# EAGLE design ArmazEthernet - Rev A2 (EAGLE 7.5.0)

## Sheet 1 of 2
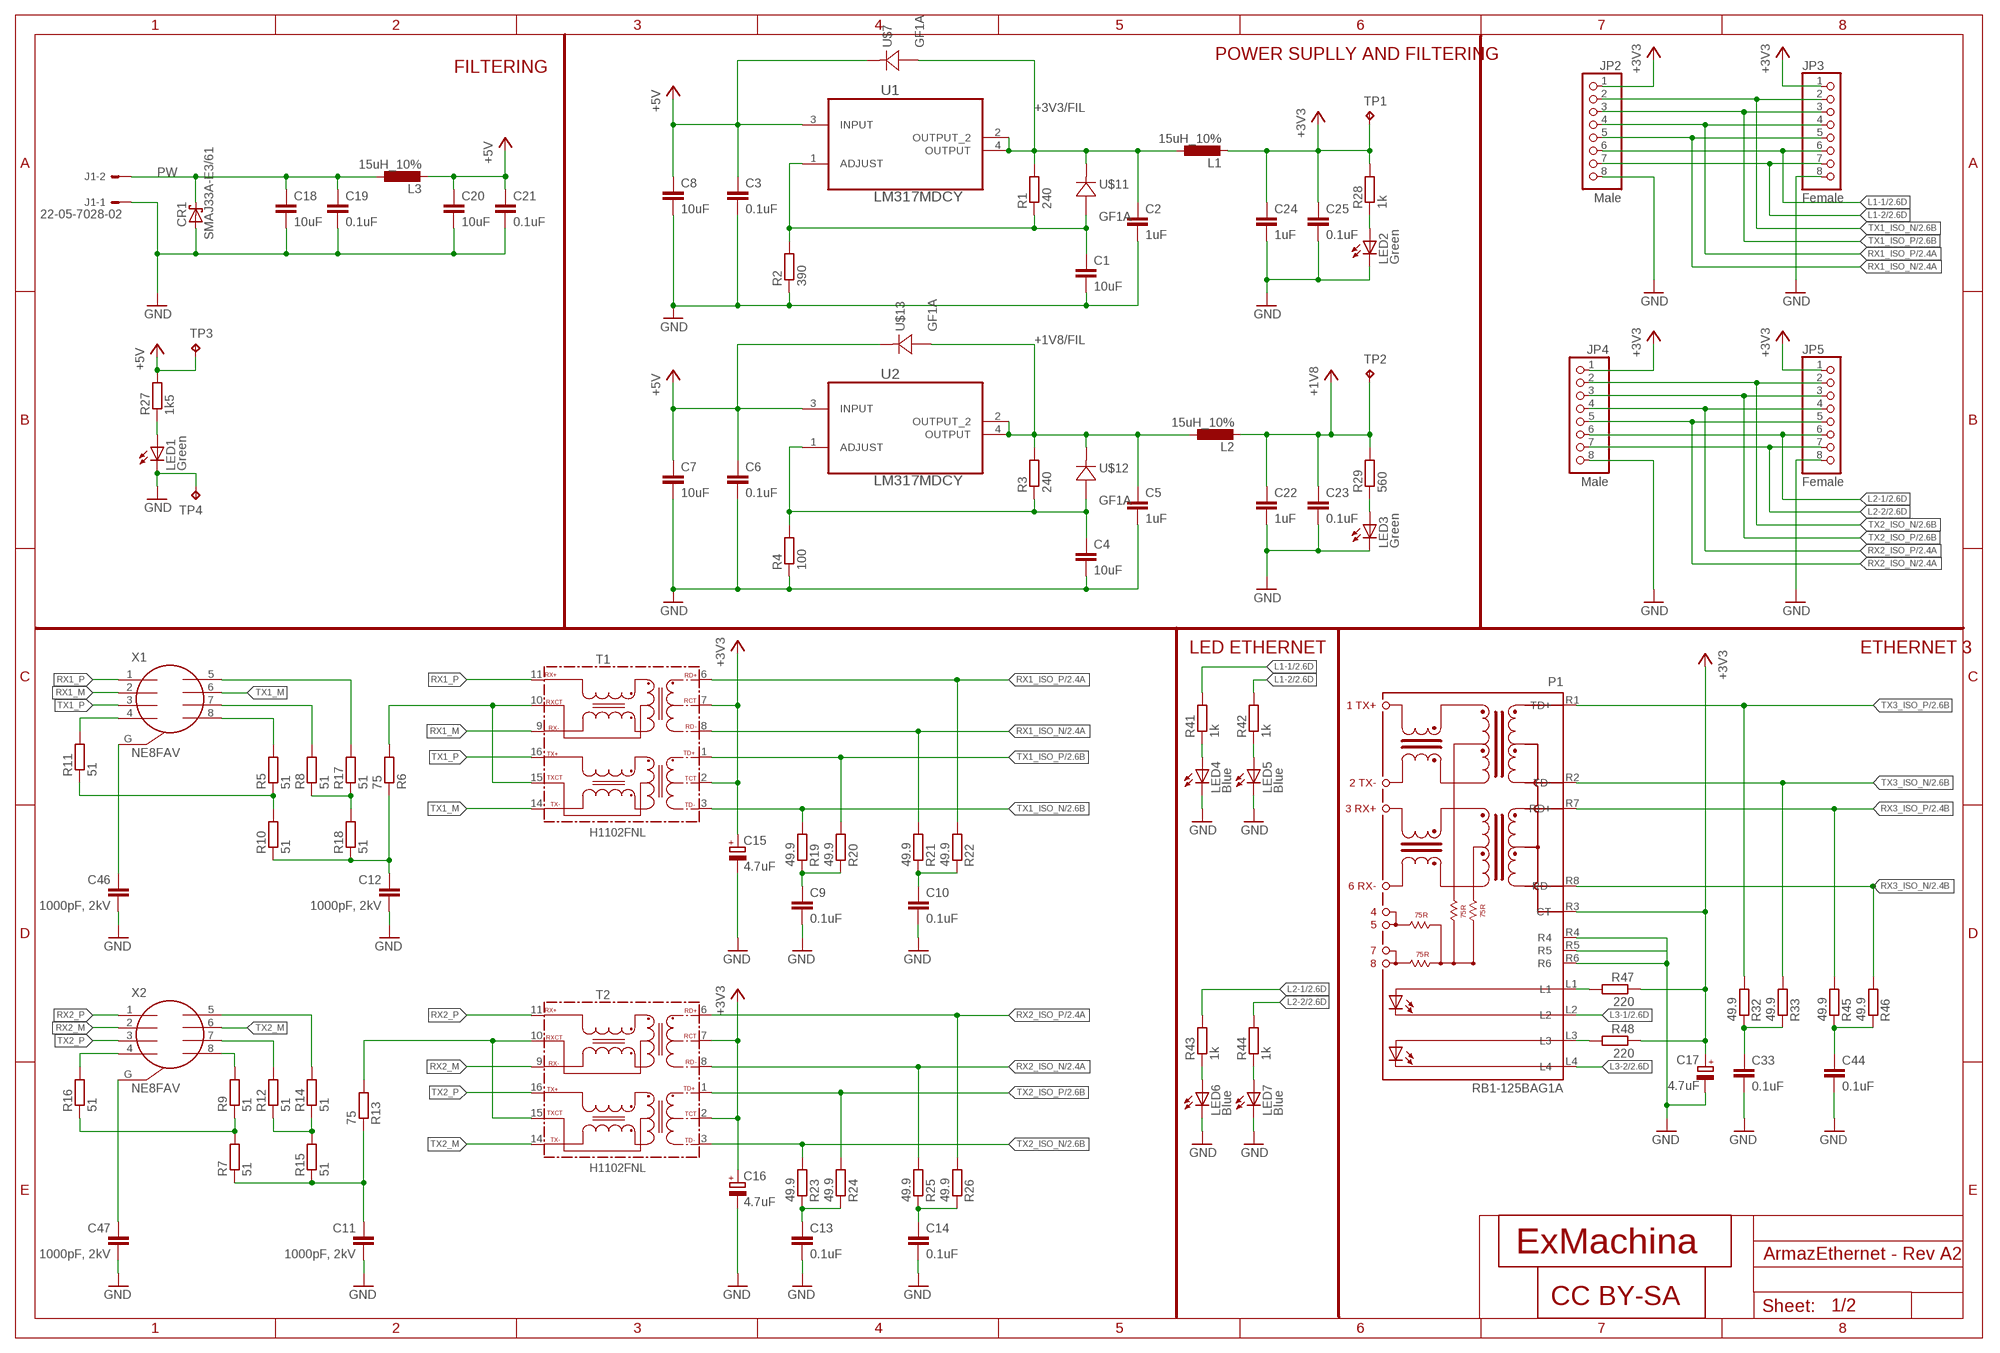
[diagram p0: schematic, sheet 1]

### Parts
C1  10uF  C-EUC0603  [C0603]
C2  1uF  C-EUC0603  [C0603]
C3  0.1uF  C-EUC0603  [C0603]
C4  10uF  C-EUC0603  [C0603]
C5  1uF  C-EUC0603  [C0603]
C6  0.1uF  C-EUC0603  [C0603]
C7  10uF  C-EUC0603  [C0603]
C8  10uF  C-EUC0603  [C0603]
C9  0.1uF  C-EUC0603  [C0603]
C10  0.1uF  C-EUC0603  [C0603]
C11  1000pF, 2kV  C-EUC1206  [C1206]
C12  1000pF, 2kV  C-EUC1206  [C1206]
C13  0.1uF  C-EUC0603  [C0603]
C14  0.1uF  C-EUC0603  [C0603]
C15  4.7uF  CPOL-EUCT3216  [CT3216]
C16  4.7uF  CPOL-EUCT3216  [CT3216]
C17  4.7uF  CPOL-EUCT3216  [CT3216]
C18  10uF  C-EUC0603  [C0603]
C19  0.1uF  C-EUC0603  [C0603]
C20  10uF  C-EUC0603  [C0603]
C21  0.1uF  C-EUC0603  [C0603]
C22  1uF  C-EUC0603  [C0603]
C23  0.1uF  C-EUC0603  [C0603]
C24  1uF  C-EUC0603  [C0603]
C25  0.1uF  C-EUC0603  [C0603]
C33  0.1uF  C-EUC0603  [C0603]
C44  0.1uF  C-EUC0603  [C0603]
C46  1000pF, 2kV  C-EUC1206  [C1206]
C47  1000pF, 2kV  C-EUC1206  [C1206]
CR1  SMAJ33A-E3/61  [DIODE_DO-214AC]
J1  22-05-7028-02  [7395-02]
JP2  Male  PINHD-1X8  [1X08]
JP3  Female  PINHD-1X8  [1X08]
JP4  Male  PINHD-1X8  [1X08]
JP5  Female  PINHD-1X8  [1X08]
L1  15uH_10%  L-EUL4532C  [L4532M]
L2  15uH_10%  L-EUL4532C  [L4532M]
L3  15uH_10%  L-EUL4532C  [L4532M]
LED1  Green  LEDCHIP-LED0603  [CHIP-LED0603]
LED2  Green  LEDCHIP-LED0603  [CHIP-LED0603]
LED3  Green  LEDCHIP-LED0603  [CHIP-LED0603]
LED4  Blue  LEDCHIP-LED0603  [CHIP-LED0603]
LED5  Blue  LEDCHIP-LED0603  [CHIP-LED0603]
LED6  Blue  LEDCHIP-LED0603  [CHIP-LED0603]
LED7  Blue  LEDCHIP-LED0603  [CHIP-LED0603]
P1  RB1-125BAG1A  [WIZNET_RB1-125BAG1A]
R1  240  R-EU_R0603  [R0603]
R2  390  R-EU_R0603  [R0603]
R3  240  R-EU_R0603  [R0603]
R4  100  R-EU_R0603  [R0603]
R5  51  R-EU_R0603  [R0603]
R6  75  R-EU_R0603  [R0603]
R7  51  R-EU_R0603  [R0603]
R8  51  R-EU_R0603  [R0603]
R9  51  R-EU_R0603  [R0603]
R10  51  R-EU_R0603  [R0603]
R11  51  R-EU_R0603  [R0603]
R12  51  R-EU_R0603  [R0603]
R13  75  R-EU_R0603  [R0603]
R14  51  R-EU_R0603  [R0603]
R15  51  R-EU_R0603  [R0603]
R16  51  R-EU_R0603  [R0603]
R17  51  R-EU_R0603  [R0603]
R18  51  R-EU_R0603  [R0603]
R19  49.9  R-EU_R0603  [R0603]
R20  49.9  R-EU_R0603  [R0603]
R21  49.9  R-EU_R0603  [R0603]
R22  49.9  R-EU_R0603  [R0603]
R23  49.9  R-EU_R0603  [R0603]
R24  49.9  R-EU_R0603  [R0603]
R25  49.9  R-EU_R0603  [R0603]
R26  49.9  R-EU_R0603  [R0603]
R27  1k5  R-EU_R0603  [R0603]
R28  1k  R-EU_R0603  [R0603]
R29  560  R-EU_R0603  [R0603]
R32  49.9  R-EU_R0603  [R0603]
R33  49.9  R-EU_R0603  [R0603]
R41  1k  R-EU_R0603  [R0603]
R42  1k  R-EU_R0603  [R0603]
R43  1k  R-EU_R0603  [R0603]
R44  1k  R-EU_R0603  [R0603]
R45  49.9  R-EU_R0603  [R0603]
R46  49.9  R-EU_R0603  [R0603]
R47  220  R-EU_R0603  [R0603]
R48  220  R-EU_R0603  [R0603]
T1  H1102FNL  [HXXXX]
T2  H1102FNL  [HXXXX]
TP1  TPB1,27  [B1,27]
TP2  TPB1,27  [B1,27]
TP3  TPB1,27  [B1,27]
TP4  TPB1,27  [B1,27]
U1  LM317MDCY  [SOT230P700X180-4N]
U2  LM317MDCY  [SOT230P700X180-4N]
U$5  EXMACHINA-LOGO-NAME  [EXM-LOGO-BASELINE]
U$6  CC-BY-SA  [CC-BY-SA]
U$7  GF1A  [DO-214BA]
U$11  GF1A  [DO-214BA]
U$12  GF1A  [DO-214BA]
U$13  GF1A  [DO-214BA]
X1  NE8FAV  [NE8FAV]
X2  NE8FAV  [NE8FAV]

### Nets
+1V8: C22.1 C23.1 L2.2 R29.2 TP2.TP ; also sheet 2
+1V8/FIL: C5.1 L2.1 R3.2 U2.2(OUTPUT_2) U2.4(OUTPUT) U$12.C U$13.A
+3V3: C15.+ C16.+ C17.+ C24.1 C25.1 JP2.1 JP3.1 JP4.1 JP5.1 L1.2 P1.R3(CT) R28.2 R47.1 R48.1 T1.2(TCT) T1.7(RCT) T2.2(TCT) T2.7(RCT) TP1.TP ; also sheet 2
+3V3/FIL: C2.1 L1.1 R1.2 U1.2(OUTPUT_2) U1.4(OUTPUT) U$7.A U$11.C
+5V: C3.1 C6.1 C7.1 C8.1 C20.1 C21.1 L3.2 R27.2 TP3.TP U1.3(INPUT) U2.3(INPUT) U$7.C U$13.C
GND: C1.2 C2.2 C3.2 C4.2 C5.2 C6.2 C7.2 C8.2 C9.2 C10.2 C11.2 C12.2 C13.2 C14.2 C15.- C16.- C17.- C18.2 C19.2 C20.2 C21.2 C22.2 C23.2 C24.2 C25.2 C33.2 C44.2 C46.2 C47.2 CR1.2(A) J1.1 JP2.8 JP3.8 JP4.8 JP5.8 LED1.C LED2.C LED3.C LED4.C LED5.C LED6.C LED7.C P1.R4 P1.R5 P1.R6 R2.1 R4.1 TP4.TP ; also sheet 2
L1-1: JP2.6 JP3.6 R41.2 ; also sheet 2
L1-2: JP2.7 JP3.7 R42.2 ; also sheet 2
L2-1: JP4.6 JP5.6 R43.2 ; also sheet 2
L2-2: JP4.7 JP5.7 R44.2 ; also sheet 2
L3-1: P1.L2 ; also sheet 2
L3-2: P1.L4 ; also sheet 2
N$1: R6.2 T1.10(RXCT) T1.15(TXCT)
N$2: C1.1 R1.1 R2.2 U1.1(ADJUST) U$11.A
N$4: R13.2 T2.10(RXCT) T2.15(TXCT)
N$5: R9.2 X2.8
N$6: C4.1 R3.1 R4.2 U2.1(ADJUST) U$12.A
N$7: R11.2 X1.4
N$8: R5.2 X1.8
N$9: R8.2 X1.7
N$10: C9.1 R19.1 R20.1
N$11: R17.2 X1.5
N$12: R12.2 X2.7
N$13: C11.1 R7.1 R13.1 R15.1
N$14: R5.1 R10.2 R11.1
N$15: R16.2 X2.4
N$16: R7.2 R9.1 R16.1
N$17: R8.1 R17.1 R18.2
N$18: R14.2 X2.5
N$19: R12.1 R14.1 R15.2
N$20: LED4.A R41.1
N$23: LED1.A R27.1
N$24: LED2.A R28.1
N$26: LED3.A R29.1
N$27: C33.1 R32.1 R33.1
N$28: LED5.A R42.1
N$29: LED6.A R43.1
N$30: LED7.A R44.1
N$31: C44.1 R45.1 R46.1
N$32: C12.1 R6.1 R10.1 R18.1
N$33: C10.1 R21.1 R22.1
N$34: P1.L3 R48.2
N$35: P1.L1 R47.2
N$36: C47.1 X2.G
N$37: C46.1 X1.G
N$40: C13.1 R23.1 R24.1
N$41: C14.1 R25.1 R26.1
PW: C18.1 C19.1 CR1.1(C) J1.2 L3.1
RX1_ISO_N: JP2.5 JP3.5 R21.2 T1.8(RD-) ; also sheet 2
RX1_ISO_P: JP2.4 JP3.4 R22.2 T1.6(RD+) ; also sheet 2
RX1_M: T1.9(RX-) X1.2
RX1_P: T1.11(RX+) X1.1
RX2_ISO_N: JP4.5 JP5.5 R25.2 T2.8(RD-) ; also sheet 2
RX2_ISO_P: JP4.4 JP5.4 R26.2 T2.6(RD+) ; also sheet 2
RX2_M: T2.9(RX-) X2.2
RX2_P: T2.11(RX+) X2.1
RX3_ISO_N: P1.R8(RD-) R46.2 ; also sheet 2
RX3_ISO_P: P1.R7(RD+) R45.2 ; also sheet 2
TX1_ISO_N: JP2.2 JP3.2 R19.2 T1.3(TD-) ; also sheet 2
TX1_ISO_P: JP2.3 JP3.3 R20.2 T1.1(TD+) ; also sheet 2
TX1_M: T1.14(TX-) X1.6
TX1_P: T1.16(TX+) X1.3
TX2_ISO_N: JP4.2 JP5.2 R23.2 T2.3(TD-) ; also sheet 2
TX2_ISO_P: JP4.3 JP5.3 R24.2 T2.1(TD+) ; also sheet 2
TX2_M: T2.14(TX-) X2.6
TX2_P: T2.16(TX+) X2.3
TX3_ISO_N: P1.R2(TD-) R33.2 ; also sheet 2
TX3_ISO_P: P1.R1(TD+) R32.2 ; also sheet 2

### Notes on the sheet
- POWER SUPLLY AND FILTERING
- FILTERING
- LED ETHERNET | ETHERNET 3

## Sheet 2 of 2
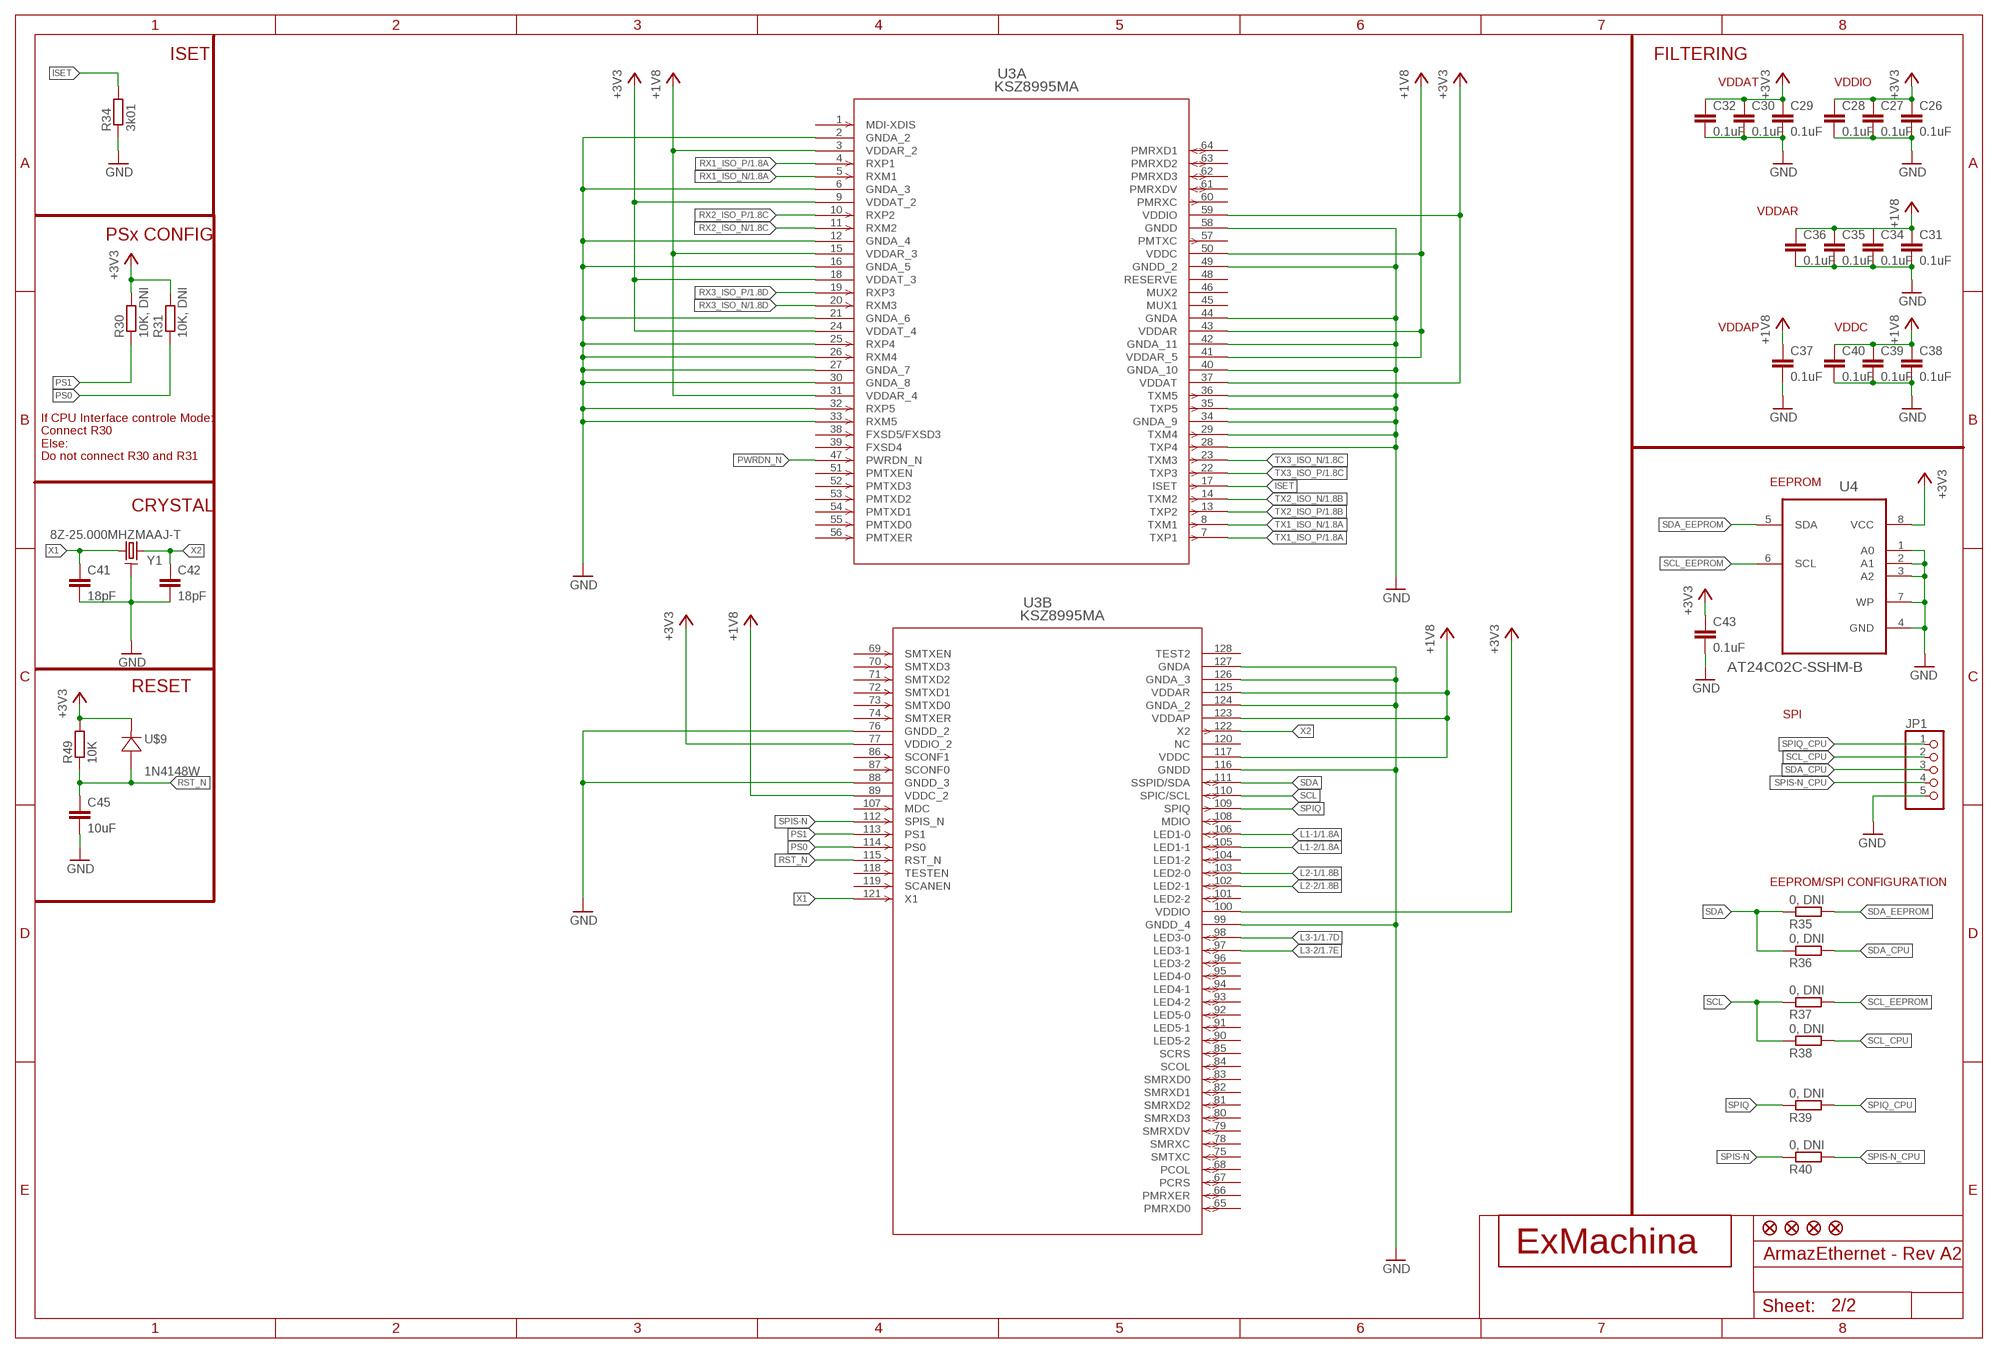
[diagram p1: schematic, sheet 2]

### Parts
C26  0.1uF  C-EUC0603  [C0603]
C27  0.1uF  C-EUC0603  [C0603]
C28  0.1uF  C-EUC0603  [C0603]
C29  0.1uF  C-EUC0603  [C0603]
C30  0.1uF  C-EUC0603  [C0603]
C31  0.1uF  C-EUC0603  [C0603]
C32  0.1uF  C-EUC0603  [C0603]
C34  0.1uF  C-EUC0603  [C0603]
C35  0.1uF  C-EUC0603  [C0603]
C36  0.1uF  C-EUC0603  [C0603]
C37  0.1uF  C-EUC0603  [C0603]
C38  0.1uF  C-EUC0603  [C0603]
C39  0.1uF  C-EUC0603  [C0603]
C40  0.1uF  C-EUC0603  [C0603]
C41  18pF  C-EUC0603  [C0603]
C42  18pF  C-EUC0603  [C0603]
C43  0.1uF  C-EUC0603  [C0603]
C45  10uF  C-EUC0603  [C0603]
JP1  PINHD-1X5  [1X05]
JP7  FIDUCIAL1X2  [FIDUCIAL-1X2]
JP8  FIDUCIAL1X2  [FIDUCIAL-1X2]
JP9  FIDUCIAL1X2  [FIDUCIAL-1X2]
JP10  FIDUCIAL1X2  [FIDUCIAL-1X2]
R30  10K, DNI  R-EU_R0603  [R0603]
R31  10K, DNI  R-EU_R0603  [R0603]
R34  3k01  R-EU_R0603  [R0603]
R35  0, DNI  R-EU_R0603  [R0603]
R36  0, DNI  R-EU_R0603  [R0603]
R37  0, DNI  R-EU_R0603  [R0603]
R38  0, DNI  R-EU_R0603  [R0603]
R39  0, DNI  R-EU_R0603  [R0603]
R40  0, DNI  R-EU_R0603  [R0603]
R49  10K  R-EU_R0603  [R0603]
U3  KSZ8995MA  [PQFP-128_MQL]
U4  AT24C02C-SSHM-B  [SOIC127P600X175-8N]
U$8  EXMACHINA-LOGO-NAME  [EXM-LOGO-BASELINE]
U$9  1N4148W  [SOD-123_MINI-SMA]
Y1  8Z-25.000MHZMAAJ-T  [SMD2.5X2]

### Nets
+1V8: C31.1 C34.1 C35.1 C36.1 C37.1 C38.1 C39.1 C40.1 U3.3(A:VDDAR_2) U3.15(A:VDDAR_3) U3.31(A:VDDAR_4) U3.41(A:VDDAR_5) U3.43(A:VDDAR) U3.50(A:VDDC) U3.89(B:VDDC_2) U3.117(B:VDDC) U3.123(B:VDDAP) U3.125(B:VDDAR) ; also sheet 1
+3V3: C26.1 C27.1 C28.1 C29.1 C30.1 C32.1 C43.1 R30.2 R31.2 R49.2 U3.9(A:VDDAT_2) U3.18(A:VDDAT_3) U3.24(A:VDDAT_4) U3.37(A:VDDAT) U3.59(A:VDDIO) U3.77(B:VDDIO_2) U3.100(B:VDDIO) U4.8(VCC) U$9.C ; also sheet 1
GND: C26.2 C27.2 C28.2 C29.2 C30.2 C31.2 C32.2 C34.2 C35.2 C36.2 C37.2 C38.2 C39.2 C40.2 C41.2 C42.2 C43.2 C45.2 JP1.5 R34.1 U3.2(A:GNDA_2) U3.6(A:GNDA_3) U3.12(A:GNDA_4) U3.16(A:GNDA_5) U3.21(A:GNDA_6) U3.25(A:RXP4) U3.26(A:RXM4) U3.27(A:GNDA_7) U3.28(A:TXP4) U3.29(A:TXM4) U3.30(A:GNDA_8) U3.32(A:RXP5) U3.33(A:RXM5) U3.34(A:GNDA_9) U3.35(A:TXP5) U3.36(A:TXM5) U3.40(A:GNDA_10) U3.42(A:GNDA_11) U3.44(A:GNDA) U3.49(A:GNDD_2) U3.58(A:GNDD) U3.76(B:GNDD_2) U3.88(B:GNDD_3) U3.99(B:GNDD_4) U3.116(B:GNDD) U3.124(B:GNDA_2) U3.126(B:GNDA_3) U3.127(B:GNDA) U4.1(A0) U4.2(A1) U4.3(A2) U4.4(GND) U4.7(WP) Y1.2 Y1.4 ; also sheet 1
ISET: R34.2 U3.17(A:ISET)
L1-1: U3.106(B:LED1-0) ; also sheet 1
L1-2: U3.105(B:LED1-1) ; also sheet 1
L2-1: U3.103(B:LED2-0) ; also sheet 1
L2-2: U3.102(B:LED2-1) ; also sheet 1
L3-1: U3.98(B:LED3-0) ; also sheet 1
L3-2: U3.97(B:LED3-1) ; also sheet 1
PS0: R31.1 U3.114(B:PS0)
PS1: R30.1 U3.113(B:PS1)
PWRDN_N: U3.47(A:PWRDN_N)
RST_N: C45.1 R49.1 U3.115(B:RST_N) U$9.A
RX1_ISO_N: U3.5(A:RXM1) ; also sheet 1
RX1_ISO_P: U3.4(A:RXP1) ; also sheet 1
RX2_ISO_N: U3.11(A:RXM2) ; also sheet 1
RX2_ISO_P: U3.10(A:RXP2) ; also sheet 1
RX3_ISO_N: U3.20(A:RXM3) ; also sheet 1
RX3_ISO_P: U3.19(A:RXP3) ; also sheet 1
SCL: R37.1 R38.1 U3.110(B:SPIC/SCL)
SCL_CPU: JP1.2 R38.2
SCL_EEPROM: R37.2 U4.6(SCL)
SDA: R35.1 R36.1 U3.111(B:SSPID/SDA)
SDA_CPU: JP1.3 R36.2
SDA_EEPROM: R35.2 U4.5(SDA)
SPIQ: R39.1 U3.109(B:SPIQ)
SPIQ_CPU: JP1.1 R39.2
SPIS-N: R40.1 U3.112(B:SPIS_N)
SPIS-N_CPU: JP1.4 R40.2
TX1_ISO_N: U3.8(A:TXM1) ; also sheet 1
TX1_ISO_P: U3.7(A:TXP1) ; also sheet 1
TX2_ISO_N: U3.14(A:TXM2) ; also sheet 1
TX2_ISO_P: U3.13(A:TXP2) ; also sheet 1
TX3_ISO_N: U3.23(A:TXM3) ; also sheet 1
TX3_ISO_P: U3.22(A:TXP3) ; also sheet 1
X1: C41.1 U3.121(B:X1) Y1.1
X2: C42.1 U3.122(B:X2) Y1.3
Unconnected: U3.1(A:MDI-XDIS) U3.38(A:FXSD5/FXSD3) U3.39(A:FXSD4) U3.45(A:MUX1) U3.46(A:MUX2) U3.48(A:RESERVE) U3.51(A:PMTXEN) U3.52(A:PMTXD3) U3.53(A:PMTXD2) U3.54(A:PMTXD1) U3.55(A:PMTXD0) U3.56(A:PMTXER) U3.57(A:PMTXC) U3.60(A:PMRXC) U3.61(A:PMRXDV) U3.62(A:PMRXD3) U3.63(A:PMRXD2) U3.64(A:PMRXD1) U3.65(B:PMRXD0) U3.66(B:PMRXER) U3.67(B:PCRS) U3.68(B:PCOL) U3.69(B:SMTXEN) U3.70(B:SMTXD3) U3.71(B:SMTXD2) U3.72(B:SMTXD1) U3.73(B:SMTXD0) U3.74(B:SMTXER) U3.75(B:SMTXC) U3.78(B:SMRXC) U3.79(B:SMRXDV) U3.80(B:SMRXD3) U3.81(B:SMRXD2) U3.82(B:SMRXD1) U3.83(B:SMRXD0) U3.84(B:SCOL) U3.85(B:SCRS) U3.86(B:SCONF1) U3.87(B:SCONF0) U3.90(B:LED5-2) U3.91(B:LED5-1) U3.92(B:LED5-0) U3.93(B:LED4-2) U3.94(B:LED4-1) U3.95(B:LED4-0) U3.96(B:LED3-2) U3.101(B:LED2-2) U3.104(B:LED1-2) U3.107(B:MDC) U3.108(B:MDIO) U3.118(B:TESTEN) U3.119(B:SCANEN) U3.120(B:NC) U3.128(B:TEST2)

### Notes on the sheet
- ISET | FILTERING
- VDDAT | VDDIO
- VDDAR
- PSx CONFIG
- VDDAP | VDDC
- If CPU Interface controle Mode:
  Connect R30
  Else:
  Do not connect R30 and R31
- EEPROM
- CRYSTAL
- RESET
- SPI
- EEPROM/SPI CONFIGURATION

## Library data of the parts
C1 C4 C7 C8 C18 C20 C45 = rcl:C-EU: CAPACITOR, European symbol; MPN: MCNP16V106M5X11; OC_NEWARK: 13M5149
C2 C5 C22 C24 = rcl:C-EU: CAPACITOR, European symbol; MPN: MC0603B105K160CT; OC_NEWARK: 06X6171
C3 C6 C9 C10 C13 C14 C19 C21 C23 C25-C40 C43 C44 = rcl:C-EU: CAPACITOR, European symbol; MPN: MC0603B104K160CT; OC_NEWARK: 06R4923
C11 C12 C46 C47 = rcl:C-EU: CAPACITOR, European symbol; MPN: MC1206B102K202CT; OC_NEWARK: 21T9879
C15-C17 = rcl:CPOL-EU: POLARIZED CAPACITOR, European symbol; MPN: MCCTA475M010; OC_NEWARK: 01M8221
C41 C42 = rcl:C-EU: CAPACITOR, European symbol; MPN: MC0603N180J500CT; OC_NEWARK: 06R5138
CR1 = diode:SMAJ33A-E3/61; COPYRIGHT: Copyright (C) 2015 Accelerated Designs. All rights reserved; FAMILY: TVS; MANUFACTURER_NAME: Vishay; MANUFACTURER_PART_NUMBER: SMAJ33A-E3/61; MPN: SMAJ33A-E3/61; OC_NEWARK: 08R3790; RSPARTNUMBER: 7103462; SECTION: Discretes; SUPERSECTION: Semiconductors; VENDOR: Vishay
J1 = con-molex:22-?-02: CONNECTOR wire to board 2.54 mm (.1 inch) pitch header; MPN: 22-05-7028; OC_FARNELL: 9731601; OC_NEWARK: 25M1728
JP1 = pinhead:PINHD-1X5: PIN HEADER; MPN: M20-9990545; OC_NEWARK: 97K6210
JP2 JP4 = pinhead:PINHD-1X8: PIN HEADER; MPN: 2211S-08G; OC_NEWARK: 08N6749
JP3 JP5 = pinhead:PINHD-1X8: PIN HEADER; MPN: 2212S-08SG-85; OC_NEWARK: 08N6773
JP7-JP10 = SparkFun:FIDUCIAL: Fiducial Alignment Points Various fiducial points for machine vision alignment.
L1-L3 = rcl:L-EU: INDUCTOR, European symbol; MPN: LQH43CN150K03L; OC_NEWARK: 74M2809
LED1-LED3 = led:LED: LED OSRAM: - CHIPLED LG R971, LG N971, LY N971, LG Q971, LY Q971, LO R971, LY R971 LH N974, LH R974 LS Q976, LO Q976, LY Q976 LO Q996 - Hyper CHIPLED LW Q18S LB Q993, LB Q99A, LB R99A - SideLED LS A670, LO A670, LY A670, LG A670, LP A670 LB A673, LV A673, LT A673, LW A673 LH A674 LY A675 LS A676, LA A676, LO A676, LY A676, LW A676 LS A679, LY A679, LG A679 - Hyper Micro SIDELED® LS Y876, LA Y876, LO Y876, LY Y876 LT Y87S - SmartLED LW L88C, LW L88S LB L89C, LB L89S, LG L890 LS L89K, LO L89K, LY L89K LS L896, LA L896, LO L896, LY L896 - TOPLED LS T670, LO T670, LY T670, LG T670, LP T670 LSG T670, LSP T670, LSY T670, LOP T670, LYG T670 LG T671, LOG T671, LSG T671 LB T673, LV T673, LT T673, LW T673 LH T674 LS T676, LA T676, LO T676, LY T676, LB T676, LH T676, LSB T676, LW T676 LB T67C, LV T67C, LT T67C, LS T67K, LO T67K, LY T67K, LW E67C LS E67B, LA E67B, LO E67B, LY E67B, LB E67C, LV E67C, LT E67C LW T67C LS T679, LY T679, LG T679 LS T770, LO T770, LY T770, LG T770, LP T770 LB T773, LV T773, LT T773, LW T773 LH T774 LS E675, LA E675, LY E675, LS T675 LS T776, LA T776, LO T776, LY T776, LB T776 LHGB T686 LT T68C, LB T68C - Hyper Mini TOPLED® LB M676 - Mini TOPLED Santana® LG M470 LS M47K, LO M47K, LY M47K Source: http://www.osram.convergy.de LUXEON: - LUMILED® LXK2-PW12-R00, LXK2-PW12-S00, LXK2-PW14-U00, LXK2-PW14-V00 LXK2-PM12-R00, LXK2-PM12-S00, LXK2-PM14-U00 LXK2-PE12-Q00, LXK2-PE12-R00, LXK2-PE12-S00, LXK2-PE14-T00, LXK2-PE14-U00 LXK2-PB12-K00, LXK2-PB12-L00, LXK2-PB12-M00, LXK2-PB14-N00, LXK2-PB14-P00, LXK2-PB14-Q00 LXK2-PR12-L00, LXK2-PR12-M00, LXK2-PR14-Q00, LXK2-PR14-R00 LXK2-PD12-Q00, LXK2-PD12-R00, LXK2-PD12-S00 LXK2-PH12-R00, LXK2-PH12-S00 LXK2-PL12-P00, LXK2-PL12-Q00, LXK2-PL12-R00 Source: www.luxeon.com KINGBRIGHT: KA-3528ASYC Source: www.kingbright.com; MPN: OVS-0604; OC_NEWARK: 15R2206
LED4-LED7 = led:LED: LED OSRAM: - CHIPLED LG R971, LG N971, LY N971, LG Q971, LY Q971, LO R971, LY R971 LH N974, LH R974 LS Q976, LO Q976, LY Q976 LO Q996 - Hyper CHIPLED LW Q18S LB Q993, LB Q99A, LB R99A - SideLED LS A670, LO A670, LY A670, LG A670, LP A670 LB A673, LV A673, LT A673, LW A673 LH A674 LY A675 LS A676, LA A676, LO A676, LY A676, LW A676 LS A679, LY A679, LG A679 - Hyper Micro SIDELED® LS Y876, LA Y876, LO Y876, LY Y876 LT Y87S - SmartLED LW L88C, LW L88S LB L89C, LB L89S, LG L890 LS L89K, LO L89K, LY L89K LS L896, LA L896, LO L896, LY L896 - TOPLED LS T670, LO T670, LY T670, LG T670, LP T670 LSG T670, LSP T670, LSY T670, LOP T670, LYG T670 LG T671, LOG T671, LSG T671 LB T673, LV T673, LT T673, LW T673 LH T674 LS T676, LA T676, LO T676, LY T676, LB T676, LH T676, LSB T676, LW T676 LB T67C, LV T67C, LT T67C, LS T67K, LO T67K, LY T67K, LW E67C LS E67B, LA E67B, LO E67B, LY E67B, LB E67C, LV E67C, LT E67C LW T67C LS T679, LY T679, LG T679 LS T770, LO T770, LY T770, LG T770, LP T770 LB T773, LV T773, LT T773, LW T773 LH T774 LS E675, LA E675, LY E675, LS T675 LS T776, LA T776, LO T776, LY T776, LB T776 LHGB T686 LT T68C, LB T68C - Hyper Mini TOPLED® LB M676 - Mini TOPLED Santana® LG M470 LS M47K, LO M47K, LY M47K Source: http://www.osram.convergy.de LUXEON: - LUMILED® LXK2-PW12-R00, LXK2-PW12-S00, LXK2-PW14-U00, LXK2-PW14-V00 LXK2-PM12-R00, LXK2-PM12-S00, LXK2-PM14-U00 LXK2-PE12-Q00, LXK2-PE12-R00, LXK2-PE12-S00, LXK2-PE14-T00, LXK2-PE14-U00 LXK2-PB12-K00, LXK2-PB12-L00, LXK2-PB12-M00, LXK2-PB14-N00, LXK2-PB14-P00, LXK2-PB14-Q00 LXK2-PR12-L00, LXK2-PR12-M00, LXK2-PR14-Q00, LXK2-PR14-R00 LXK2-PD12-Q00, LXK2-PD12-R00, LXK2-PD12-S00 LXK2-PH12-R00, LXK2-PH12-S00 LXK2-PL12-P00, LXK2-PL12-Q00, LXK2-PL12-R00 Source: www.luxeon.com KINGBRIGHT: KA-3528ASYC Source: www.kingbright.com; MPN: OVS-0603; OC_NEWARK: 15R2205
P1 = con-wiznet:RB1-125BAG1A: Accessory RJ-45 With Transformer Connector - UDE; OC_NEWARK: unknown
R1 R3 = rcl:R-EU_: RESISTOR, European symbol; MPN: MC0063W06031240R; OC_NEWARK: 94W5763
R2 = rcl:R-EU_: RESISTOR, European symbol; MF: Multicomp Passives; MPN: MC0063W06031390R; OC_NEWARK: 58K4586
R4 = rcl:R-EU_: RESISTOR, European symbol; MF: Multicomp Passives; MPN: MC0063W06031100R; OC_NEWARK: 58K4446
R5 R7-R12 R14-R18 = rcl:R-EU_: RESISTOR, European symbol; MF: Multicomp Passives; MPN: MC0063W0603151R; OC_NEWARK: 58K4614
R6 R13 = rcl:R-EU_: RESISTOR, European symbol; MF: Multicomp Passives; MPN: MC0063W0603175R; OC_NEWARK: 58K4654
R19-R26 R32 R33 R45 R46 = rcl:R-EU_: RESISTOR, European symbol; MPN: MC0603SAF499JT5E; OC_NEWARK: 79M5983
R27 = rcl:R-EU_: RESISTOR, European symbol; MF: Multicomp Passives; MPN: MC0063W060311K5; OC_NEWARK: 58K4488
R28 R41-R44 = rcl:R-EU_: RESISTOR, European symbol; MPN: MCMR06X1001FTL; OC_NEWARK: 86T3505
R29 = rcl:R-EU_: RESISTOR, European symbol; MPN: MCMR06X1501FTL; OC_NEWARK: 86T3542
R30 R31 R49 = rcl:R-EU_: RESISTOR, European symbol; MF: Multicomp Passives; MPN: MC0063W0603110K; OC_NEWARK: 58K4450
R34 = rcl:R-EU_: RESISTOR, European symbol; MPN: MC0063W060313K01; OC_NEWARK: 94W5780
R35-R40 = rcl:R-EU_: RESISTOR, European symbol; MF: Multicomp Passives; MPN: MC0603WG00000T5E-TC; OC_NEWARK: 58K4684
R47 R48 = rcl:R-EU_: RESISTOR, European symbol; MF: Multicomp Passives; MPN: MC0063W06031220R; OC_NEWARK: 58K4526
T1 T2 = pulse:H1102FNL; OC_NEWARK: unknown
TP1-TP4 = testpad:TP: Test pad; OC_NEWARK: unknown
U1 U2 = ti:LM317MDCY: IC ADJ LINEAR REG 1.25V TO 37V; MF: TEXAS INSTRUMENTS; MPN: LM317MDCY; OC_FARNELL: 1648658; OC_NEWARK: 75C0818; PACKAGE: SOT-223-3; SUPPLIER: TEXAS INSTRUMENTS
U3 = Micrel_By_element14_Batch_1:KSZ8995MA; COPYRIGHT: Copyright (C) 2015 Accelerated Designs. All rights reserved; MANUFACTURER_PART_NUMBER: ksz8995ma; MPN: KSZ8995MA; OC_NEWARK: 70Y9044; VENDOR: MICREL
U4 = atmel:AT24C02C-SSHM-B: SERIAL EEPROM IC Memory Size:2Kbit,8-SOIC; MPN: AT24C02C-SSHM-B; OC_FARNELL: 1971995; OC_NEWARK: 68T4066; PACKAGE: 8SOIC; SUPPLIER: ATMEL
U$5 U$8 = exmachina:EXMACHINA-LOGO; OC_NEWARK: unknown
U$6 = cc-by-sa:CC-BY-SA; OC_NEWARK: unknown
U$7 U$11-U$13 = diode:GF1A; MPN: GF1B-E3/67A; OC_NEWARK: 05R5601
U$9 = diode:1N4148W; MPN: 1N4148W; OC_NEWARK: 01P4213
X1 X2 = con-neutrik_ag:NE8; MPN: NE8FAV; OC_FARNELL: unknown; OC_NEWARK: 01M8373
Y1 = crystal:8Z; MPN: 8Z-25.000MAAJ-T; OC_NEWARK: 84R5794

## Board
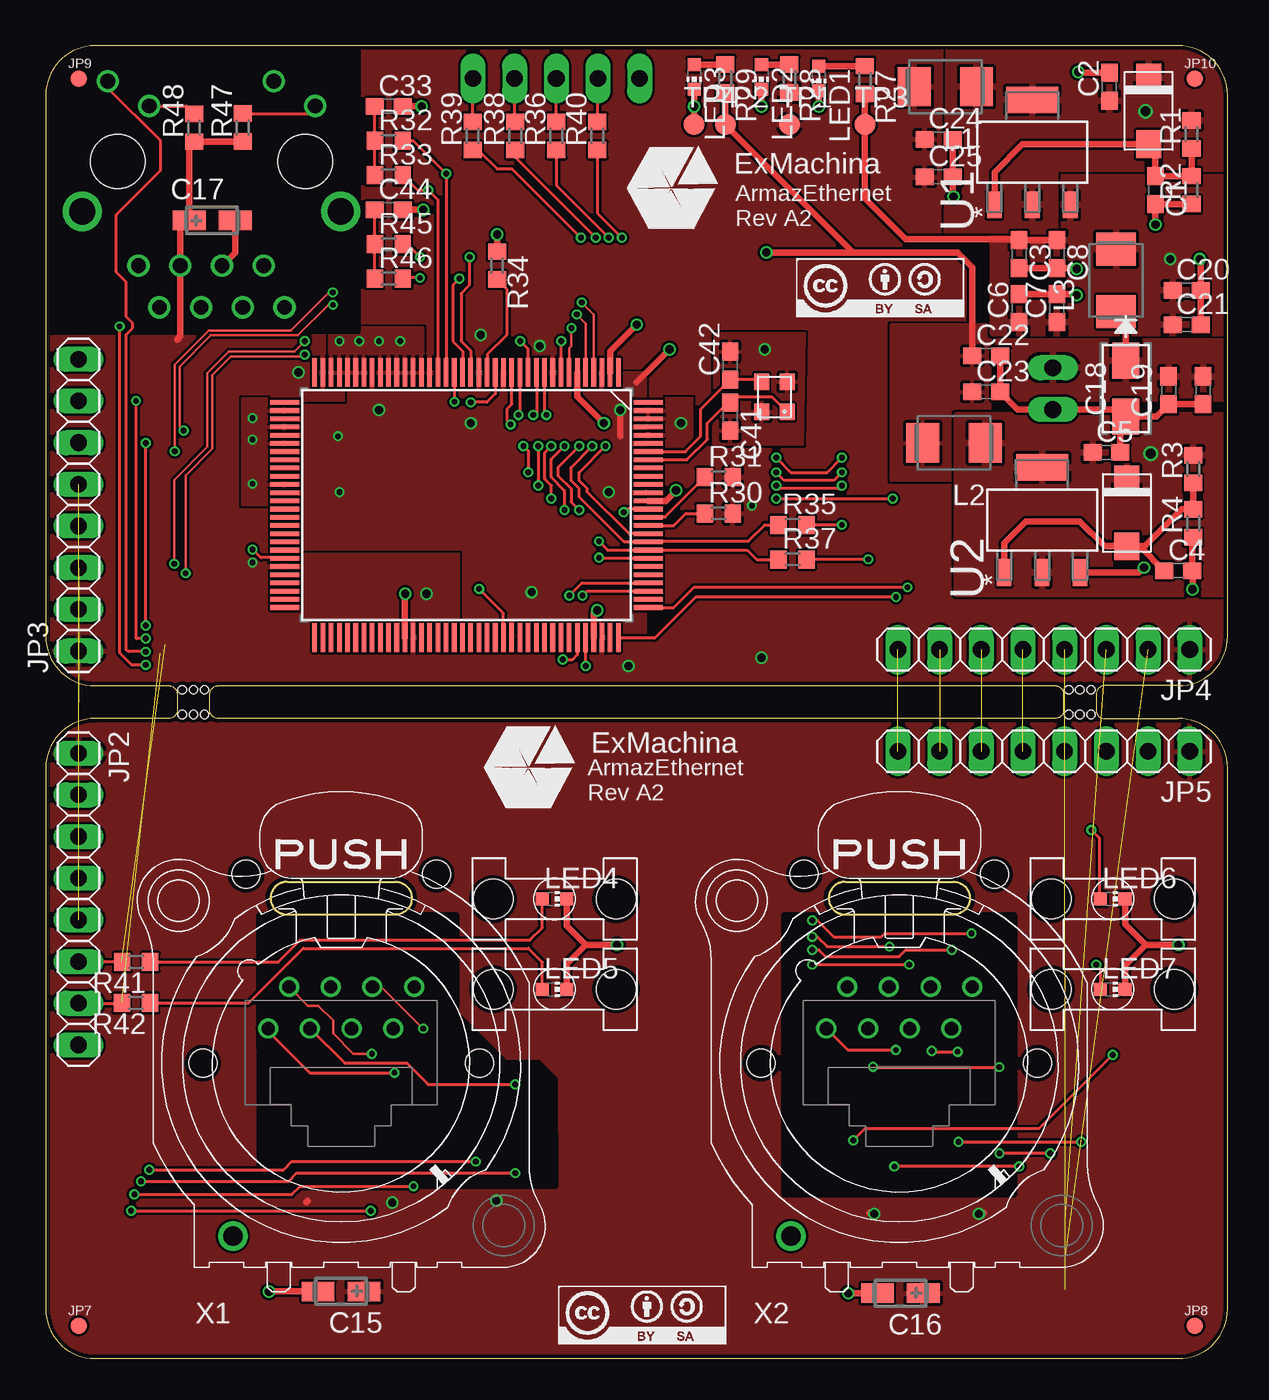
[diagram p2: board, top side]
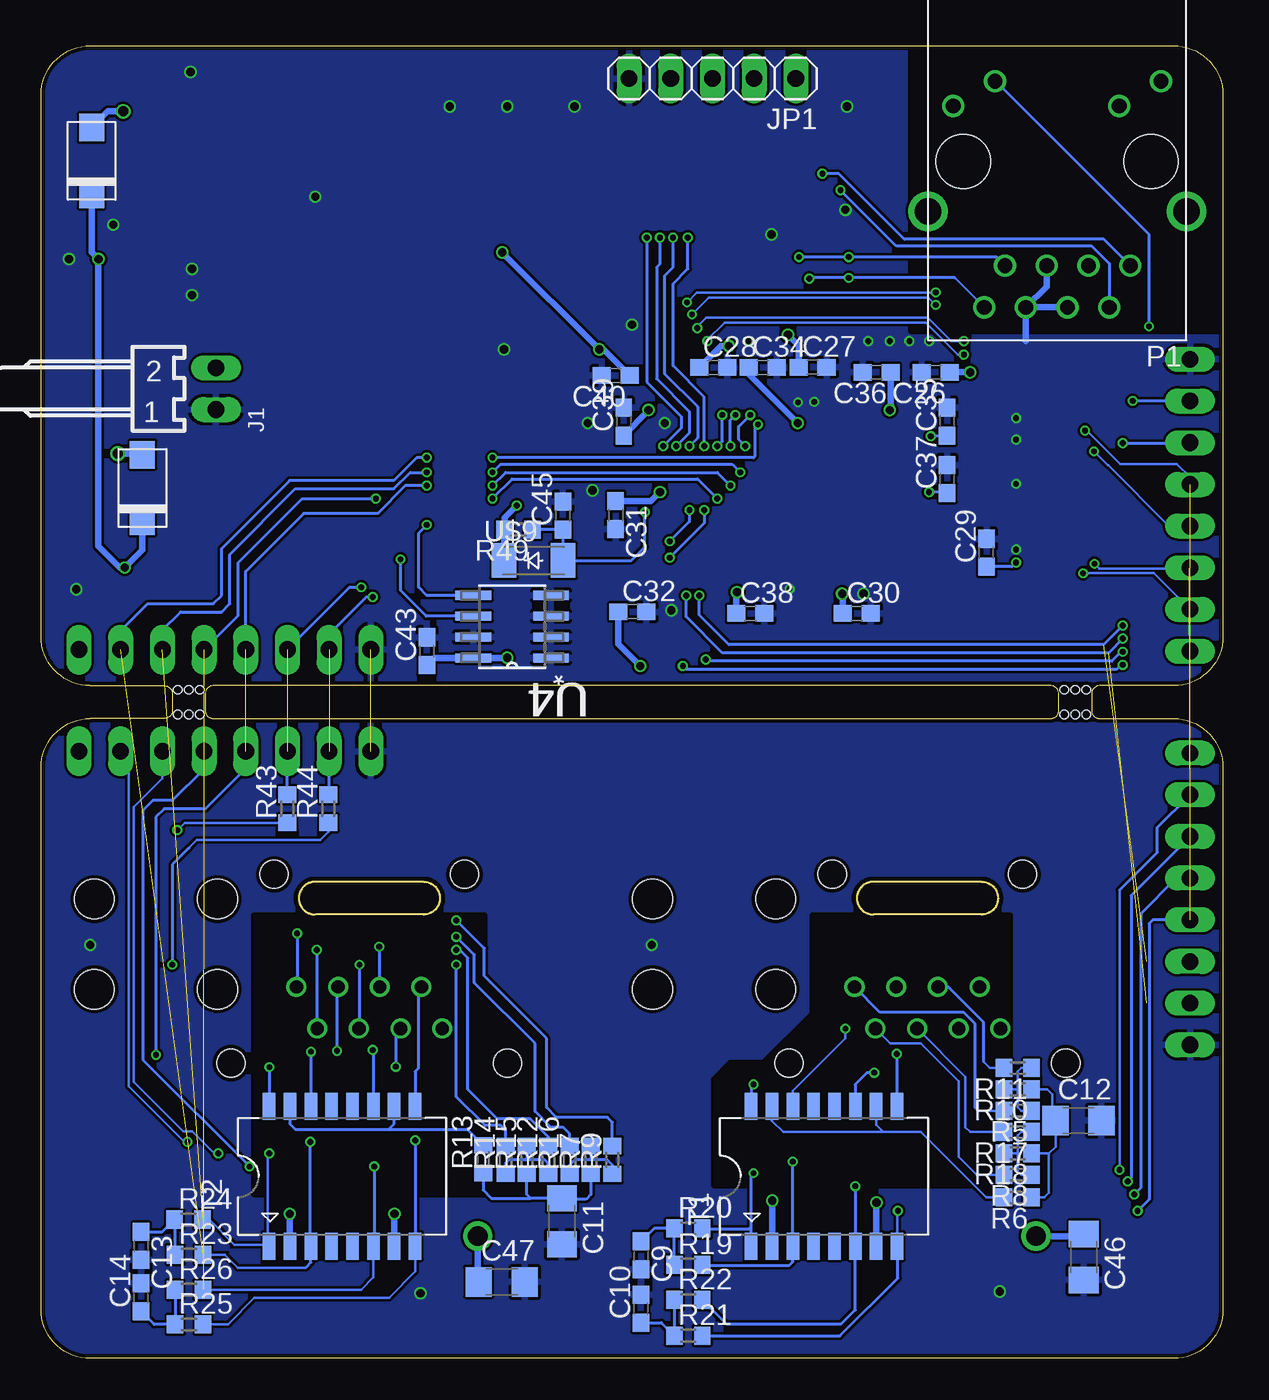
[diagram p3: board, bottom side, seen from below]

Size 72 x 80 mm. Coordinates in mm from the lower left corner, seen from the top.
Outline: 0,36 0,3 arc90 3,0 69,0 arc90 72,3 72,36 arc90 69,39 64.5,39 arc-90 64,39.5 64,40.5 arc-90 64.5,41 69,41 arc90 72,44 72,77 arc90 69,80 3,80 arc90 0,77 0,44 arc90 3,41 7.5,41 arc-90 8,40.5 8,39.5 arc-90 7.5,39 3,39 arc90 0,36
Outline: 61.5,39 10.5,39 arc-90 10,39.5 10,40.5 arc-90 10.5,41 61.5,41 arc-90 62,40.5 62,39.5 arc-90 61.5,39
Copper layers (1*16): Top 0.018mm / dielectric 1.55mm / Bottom 0.018mm
Design rules "eC_2Layer_PClass6_BaseCopperO18_eCDefault *": minimum track width 0.15mm, minimum drill 0.35mm, track to track 0.15mm, track to pad 0.15mm, pad to pad 0.15mm, via to via 0.15mm, smd to smd 0mil, copper to edge 0.25mm, drill to drill 0.35mm, minimum pad ring 0.175mm, minimum via ring 0.125mm, stop-mask expansion 0mil, vias tented up to drill 0.45mm, thermal gap 0.2mm
Holes 0.5 mm at 9.68,40.75 9,39.25 9,40.75 8.32,39.25 9.68,39.25 8.32,40.75 63.67,40.75 62.33,40.75 63,40.75 63,39.25 62.33,39.25 63.67,39.25
tRestrict: area 13,10.5 to 31,27; area 45,10 to 59,27; area 0.4,62.6 to 19,80
bRestrict: area 13,10.5 to 31,27; area 45,10 to 59,27; area 0.5,62.6 to 19,80

### Footprints (pad centres in the part's own frame; a part is rotated, then mirrored left to right if it is on the bottom)
C0603 = smd 1.1 x 1: 1 -0.85,0; 2 0.85,0
C1206 = smd 1.6 x 1.8: 1 -1.4,0; 2 1.4,0
CT3216 = smd 2 x 1.2: + -1.4,0; - 1.4,0
DIODE_DO-214AC = smd 2.184 x 1.651: 1 -1.702,0; 2 1.702,0
7395-02 = drill 1.016 long: 1 1.27,0; 2 -1.27,0
1X05 = drill 1.016 long: 1 -5.08,0; 2 -2.54,0; 3 0,0; 4 2.54,0; 5 5.08,0
1X08 = drill 1.016 long: 1 -8.89,0; 2 -6.35,0; 3 -3.81,0; 4 -1.27,0; 5 1.27,0; 6 3.81,0; 7 6.35,0; 8 8.89,0
FIDUCIAL-1X2 = smd 1 x 1: 1 0,0
L4532M = smd 2 x 2.4: 1 -1.9,0; 2 1.9,0
CHIP-LED0603 = smd 0.8 x 0.8: A 0,-0.75; C 0,0.75
WIZNET_RB1-125BAG1A = drill 0.9: L1 6.325,-3.38; L2 3.784,-4.899; L3 -3.786,-3.379; L4 -6.325,-4.9 | drill 0.9 pad 1.3: R1 -4.446,6.349; R2 -3.176,8.889; R3 -1.906,6.349; R4 -0.636,8.889; R5 0.634,6.349; R6 1.904,8.889; R7 3.174,6.349; R8 4.444,8.889 | drill 1.6 pad 2.184: S1 -7.876,3.049; S2 7.874,3.049 | hole 3.3: 5.714,-0.001; -5.716,-0.001
R0603 = smd 1 x 1.1: 1 -0.85,0; 2 0.85,0
HXXXX = smd 0.762 x 1.651: 1 -4.445,-4.255; 2 -3.175,-4.255; 3 -1.905,-4.255; 4 -0.635,-4.255; 5 0.635,-4.255; 6 1.905,-4.255; 7 3.175,-4.255; 8 4.445,-4.255; 9 4.445,4.255; 10 3.175,4.255; 11 1.905,4.255; 12 0.635,4.255; 13 -0.635,4.255; 14 -1.905,4.255; 15 -3.175,4.255; 16 -4.445,4.255
B1,27 = smd 1.27 x 1.27: TP 0,0
SOT230P700X180-4N = smd 1.626 x 0.889: 1 -3.2,2.311; 2 -3.2,0; 3 -3.2,-2.311 | smd 1.626 x 3.175: 4 3.2,0
PQFP-128_MQL = smd 1.753 x 0.279: 1 -8.077,9.25; 2 -8.077,8.75; 3 -8.077,8.25; 4 -8.077,7.75; 5 -8.077,7.25; 6 -8.077,6.75; 7 -8.077,6.25; 8 -8.077,5.75; 9 -8.077,5.25; 10 -8.077,4.75; 11 -8.077,4.25; 12 -8.077,3.75; 13 -8.077,3.25; 14 -8.077,2.75; 15 -8.077,2.25; 16 -8.077,1.75; 17 -8.077,1.25; 18 -8.077,0.75; 19 -8.077,0.25; 20 -8.077,-0.25; 21 -8.077,-0.75; 22 -8.077,-1.25; 23 -8.077,-1.75; 24 -8.077,-2.25; 25 -8.077,-2.75; 26 -8.077,-3.25; 27 -8.077,-3.75; 28 -8.077,-4.25; 29 -8.077,-4.75; 30 -8.077,-5.25; 31 -8.077,-5.75; 32 -8.077,-6.25; 33 -8.077,-6.75; 34 -8.077,-7.25; 35 -8.077,-7.75; 36 -8.077,-8.25; 37 -8.077,-8.75; 38 -8.077,-9.25; 65 8.077,-9.25; 66 8.077,-8.75; 67 8.077,-8.25; 68 8.077,-7.75; 69 8.077,-7.25; 70 8.077,-6.75; 71 8.077,-6.25; 72 8.077,-5.75; 73 8.077,-5.25; 74 8.077,-4.75; 75 8.077,-4.25; 76 8.077,-3.75; 77 8.077,-3.25; 78 8.077,-2.75; 79 8.077,-2.25; 80 8.077,-1.75; 81 8.077,-1.25; 82 8.077,-0.75; 83 8.077,-0.25; 84 8.077,0.25; 85 8.077,0.75; 86 8.077,1.25; 87 8.077,1.75; 88 8.077,2.25; 89 8.077,2.75; 90 8.077,3.25; 91 8.077,3.75; 92 8.077,4.25; 93 8.077,4.75; 94 8.077,5.25; 95 8.077,5.75; 96 8.077,6.25; 97 8.077,6.75; 98 8.077,7.25; 99 8.077,7.75; 100 8.077,8.25; 101 8.077,8.75; 102 8.077,9.25 | smd 0.279 x 1.753: 39 -6.25,-11.074; 40 -5.75,-11.074; 41 -5.25,-11.074; 42 -4.75,-11.074; 43 -4.25,-11.074; 44 -3.75,-11.074; 45 -3.25,-11.074; 46 -2.75,-11.074; 47 -2.25,-11.074; 48 -1.75,-11.074; 49 -1.25,-11.074; 50 -0.75,-11.074; 51 -0.25,-11.074; 52 0.25,-11.074; 53 0.75,-11.074; 54 1.25,-11.074; 55 1.75,-11.074; 56 2.25,-11.074; 57 2.75,-11.074; 58 3.25,-11.074; 59 3.75,-11.074; 60 4.25,-11.074; 61 4.75,-11.074; 62 5.25,-11.074; 63 5.75,-11.074; 64 6.25,-11.074; 103 6.25,11.074; 104 5.75,11.074; 105 5.25,11.074; 106 4.75,11.074; 107 4.25,11.074; 108 3.75,11.074; 109 3.25,11.074; 110 2.75,11.074; 111 2.25,11.074; 112 1.75,11.074; 113 1.25,11.074; 114 0.75,11.074; 115 0.25,11.074; 116 -0.25,11.074; 117 -0.75,11.074; 118 -1.25,11.074; 119 -1.75,11.074; 120 -2.25,11.074; 121 -2.75,11.074; 122 -3.25,11.074; 123 -3.75,11.074; 124 -4.25,11.074; 125 -4.75,11.074; 126 -5.25,11.074; 127 -5.75,11.074; 128 -6.25,11.074
SOIC127P600X175-8N = smd 2.184 x 0.559: 1 -2.362,1.905; 2 -2.362,0.635; 3 -2.362,-0.635; 4 -2.362,-1.905; 5 2.362,-1.905; 6 2.362,-0.635; 7 2.362,0.635; 8 2.362,1.905
1275.100 = hole 2.4: 3.75,0; -3.75,0
DO-214BA = smd 1.676 x 1.524: A 2.032,0; C -2.032,0
SOD-123_MINI-SMA = smd 1.5 x 2.1: A 1.8,0; C -1.8,0
NE8FAV = drill 0.813: 1 -4.445,2.108; 2 -3.175,4.648; 3 -1.905,2.108; 4 -0.635,4.648; 5 0.635,2.108; 6 1.905,4.648; 7 3.175,2.108; 8 4.445,4.648 | drill 1.194: G -6.604,-10.541 | hole 1.7: -8.425,0; 8.425,0; 5.8,11.5; -5.8,11.5
SMD2.5X2 = smd 1 x 0.9: 1 -0.925,-0.775; 2 0.925,-0.775; 3 0.925,0.775; 4 -0.925,0.775

### Placement (x,y rotation side)
C1  67.6,71.2 270 top
C2  64.8,77.5 90 top
C3  59.3,67.3 270 top
C4  69,48 0 top
C5  64.62,55.21 0 top
C6  59.3,64 90 top
C7  61.6,64 90 top
C8  61.6,67.3 270 top
C9  35.44,6.28 270 bottom
C10  35.45,3.03 90 bottom
C11  40.27,8.36 270 bottom
C12  8.8,14.5 0 bottom
C13  65.91,6.86 270 bottom
C14  65.91,3.72 90 bottom
C15  17.99,4.09 180 top
C16  52.07,3.98 180 top
C17  10.14,69.35 0 top
C18  68.4,59 270 top
C19  70.5,59 270 top
C20  69.5,65.1 0 top
C21  69.5,63 0 top
C22  57.3,61.1 0 top
C23  57.3,58.9 0 top
C24  54.4,74.3 0 top
C25  54.4,72 0 top
C26  17.5,60.1 180 bottom
C27  25,60.4 0 bottom
C28  31.05,60.39 0 bottom
C29  14.4,49.1 90 bottom
C30  22.3,45.4 0 bottom
C31  37,51.4 270 bottom
C32  35.98,45.5 0 bottom
C33  20.9,76.3 0 top
C34  28.04,60.39 0 bottom
C35  16.8,57.1 90 bottom
C36  21.1,60.1 180 bottom
C37  16.8,53.6 90 bottom
C38  28.8,45.4 0 bottom
C39  36.5,57.1 90 bottom
C40  37,59.9 180 bottom
C41  41.7,57.4 270 top
C42  41.7,60.5 90 top
C43  48.5,43.1 90 bottom
C44  20.9,70 0 top
C45  40.21,51.36 90 bottom
C46  8.48,6.18 270 bottom
C47  43.93,4.67 0 bottom
CR1  65.8,59.1 270 top
J1  61.35,59.1 270 bottom
JP1  31.1,78 180 bottom
JP2  2,28 270 top
JP3  2,52 90 top
JP4  60.8,43.2 180 top
JP5  60.8,37 180 top
JP7  2,2 0 top
JP8  70,2 0 top
JP9  2,78 0 top
JP10  70,78 0 top
L1  54.8,77.5 180 top
L2  55.34,55.79 180 top
L3  65.2,65.7 90 top
LED1  47.1,78 180 top
LED2  43.6,78.1 180 top
LED3  39.5,78.1 180 top
LED4  31,28 270 top
LED5  31,22.5 270 top
LED6  65,28 270 top
LED7  65,22.5 270 top
P1  10.1,72.94 180 bottom
R1  69.8,74.6 90 top
R2  69.8,71.2 90 top
R3  69.9,54.2 90 top
R4  69.9,50.9 90 top
R5  12.5,15.1 180 bottom
R6  12.5,9.81 180 bottom
R7  38.5,12.1 90 bottom
R8  12.5,11.2 180 bottom
R9  37.2,12.1 90 bottom
R10  12.5,16.4 180 bottom
R11  12.5,17.7 180 bottom
R12  41.1,12.1 90 bottom
R13  45.07,12.14 90 bottom
R14  43.7,12.1 90 bottom
R15  42.4,12.1 90 bottom
R16  39.8,12.1 90 bottom
R17  12.5,13.8 180 bottom
R18  12.5,12.5 180 bottom
R19  32.57,5.7 0 bottom
R20  32.57,7.92 0 bottom
R21  32.57,1.39 0 bottom
R22  32.57,3.56 0 bottom
R23  62.98,6.33 0 bottom
R24  63.01,8.47 0 bottom
R25  62.98,2.08 0 bottom
R26  62.99,4.19 0 bottom
R27  49.9,77.9 270 top
R28  45.3,78 270 top
R29  41.4,78 270 top
R30  41,51.5 0 top
R31  41,53.7 0 top
R32  20.9,74.2 0 top
R33  20.9,72.1 0 top
R34  27.5,66.6 270 top
R35  45.5,50.8 0 top
R36  31.1,74.5 90 top
R37  45.5,48.7 0 top
R38  28.6,74.5 90 top
R39  26,74.5 90 top
R40  33.6,74.5 90 top
R41  5.51,24.16 180 top
R42  5.49,21.66 180 top
R43  57,33.5 90 bottom
R44  54.5,33.5 90 bottom
R45  20.9,67.9 0 top
R46  20.9,65.8 0 top
R47  12,75.01 90 top
R48  9.04,75 90 top
R49  42.91,50.51 180 bottom
T1  24.3,11.1 0 bottom
T2  53.66,11.1 0 bottom
TP1  45.3,75.2 0 top
TP2  41.4,75.2 0 top
TP3  49.9,75.2 0 top
TP4  39.5,75.2 0 top
U1  60.1,73.5 90 top
U2  60.7,51.1 90 top
U3  25.64,52.02 270 top
U4  43.3,44.6 180 bottom
U$1  [1275.100]  65,28 180 top
U$2  [1275.100]  65,22.5 180 top
U$3  [1275.100]  31,28 180 top
U$4  [1275.100]  31,22.5 180 top
U$5  38.1,71.3 0 top
U$6  51,65.7 0 top
U$7  68.92,72.98 90 bottom
U$8  29.4,36 0 top
U$9  42,48.63 0 bottom
U$10  CC-BY-SA  [CC-BY-SA]  36.5,3.1 0 top
U$11  67.19,76.03 270 top
U$12  65.86,51.53 270 top
U$13  65.82,53.05 90 bottom
X1  18,18 0 top
X2  52,18 0 top
Y1  44.4,58.6 90 top

### Tracks (layer width: path | path; a pad name or v marks a point on that pad's centre or on a via)
+1V8  (via drill 0.35, 0.5)
  Top 0.406: R29.2 TP2.TP 49.2,67.4 | 49.2,67.4 55.55,67.4 56.45,66.5 C22.1 | 49.2,67.4 v43.9,67.4 | v38,61.5 36,59.5 | v35,57.8 35,56.2 | v20.3,57.8 20.3,57.7
  Bottom 0.178: C37.1 16.85,52.8 v17.9,52.8 | C35.1 16.85,56.2 v17.8,56.2
  Bottom 0.406: C40.1 37.75,61.5 v38,61.5 v43.9,67.4 | C38.1 29.65,46.65 v29.6,46.7 | v35,57.8 35,57.75 C39.1 | C31.1 34.85,52.25 v34.3,52.8 | C36.1 20.25,57.85 v20.3,57.8 | v25.9,57 28.89,59.98 C34.1
  pour Top (rank 4): 18.8,60.05 18.5,60.05 18.5,58 15,58 14.8,49.4 25.5,49.4 25.5,44.18 36.5,44.18 36.5,60 36.37,60
  pour Top (rank 4): 55,53.5 51.5,53.5 51.5,63 57.5,63 57.5,53.5
+1V8/FIL  (via drill 0.6)
  Bottom 0.406: U$13.A 65.89,55.15 v67.32,55.15 67.34,55.15
  pour Top (rank 3): 55.5,57.5 55.5,46.6 73.5,46.6 73.5,57.5
+3V3  (via drill 0.35, 0.5, 0.5 pad 0.41)  (1 unrouted)
  Top 0.406: v50.47,8.81 50.24,8.81 50.16,8.89 | v56.84,8.81 57.07,8.81 57.15,8.89 | 15.95,9.6 15.88,9.53 | v23.2,46.6 23.2,46.7 | v43.02,51.98 43,52 | R47.1 R48.1 arc90 R48.1 8.74,73.85 C17.+ 8.2,68.81 P1.R3 8.2,62.3 8,62.1
  Bottom 0.178: v12.6,48.5 12.85,48.25 C29.1 | U$9.C 43.77,48.63
  Bottom 0.406: T2.7 50.48,8.8 v50.47,8.81 | T2.2 56.84,8.8 v56.84,8.81 | C43.1 48.05,42.7 U4.8 v43.6,42.7 | C30.1 23.15,46.55 v23.2,46.6 | C32.1 36.83,43.52 v35.5,42.2 | C26.1 v15.4,60.1 | C27.1 25.85,61.73 v26.5,62.38 | C28.1 30.59,61.7 v30.1,61.7 | v27.45,9.62 27.45,6.87 T1.2 | T1.7 21.12,9.48 v21.1,9.5 | 43.77,48.63 R49.2 43.76,51.24 v43.02,51.98
  pour Top (rank 5): -10.79,81.28 89.69,81.47 89.53,-3.81 -10.79,-3.31
+3V3/FIL  (via drill 0.6)
  Bottom 0.406: U$7.A 67.93,76 v67,76
  pour Top: 73.5,72.5 73.5,80.5 55,80.5 54.9,68.6 61.5,68.6 61.5,72.5
+5V  (via drill 0.5)
  Top 0.406: U2.3 66.6,47.9 v66.9,48.2 | R27.2 TP3.TP 49.9,70.7 52.4,68.2 59.25,68.2 C3.1 C8.1
  Bottom 0.406: U$7.C 68.92,67.42 v68.5,67 68.5,49.5 67.2,48.2 v66.9,48.2 65.82,49.28 U$13.C
  pour Top (rank 2): 57.7,72 57.7,62.5 72,62.5 72,72
GND  (via drill 0.35, 0.5, 0.5 pad 0.41)  (1 unrouted)
  Top 0.178: 45.17,59.23 Y1.2 | U3.58 14.53,48.8 13.1,48.8 v12.6,49.3 | U3.21 24.89,58.31 v24.9,58.3 | U3.16 27.39,58.78 26.87,58.27 v25.89,58.27 | U3.88 27.89,45.41 v26.4,46.9 | U3.12 29.39,61.52 v28.9,62
  Top 0.406: C15.- 13.61,4.09 v13.6,4.08 | TP4.TP v39.5,76.3 LED3.C | LED2.C v43.6,76.3 | LED1.C v47.1,76.3 | CR1.2 65.45,57.05 65.45,55.23 C5.2 | C22.2 C23.2 59.22,57.83 J1.1 65.37,57.83 arc-90 CR1.2 | CR1.2 67.65,57.4 C18.2 C19.2 | C20.2 C21.2 | 70,49.95 R4.1 69.85,50 C4.2 v69.86,46.88 | R2.1 C1.2 v67.6,69.1 | C2.2 62.95,78.35 v62.9,78.4 | C24.2 C25.2 55.25,70.85 v55.3,70.8 | C6.2 C7.2 62.75,64.85 v62.8,64.8 | C3.2 C8.2 62.75,66.45 v62.8,66.4 | R34.1 v27.5,68.5 | U3.2 34.38,61.38 v36,63 | U3.6 32.38,58.62 v34,57 | U3.76 21.89,46.59 v21.9,46.6 | U3.99 33.38,45.38 v33.6,45.6 | U3.116 37.77,52.27 v38.4,52.9 | C33.2 v22.9,76.3 | C44.2 v23,70 | C17.- 11.54,67.4 P1.R5 | LED6.C 65.75,26.45 67,25.2 | 67,25.2 v69,25.2 | 67,25.2 65.75,23.95 LED7.C | LED5.C 31.75,24.05 32.9,25.2 | 32.9,25.2 v34.8,25.2 | LED4.C 31.75,26.35 32.9,25.2 | v48.89,3.98 C16.-
  Top 0.407: C20.2 70.35,66.95 v70.3,67
  Bottom 0.406: v43.6,76.3 43.6,76.4 43.5,76.5 | v47.1,76.3 47.1,76.4 47,76.5 | v67.6,69.1 67.5,69 | v62.8,64.8 62.8,64.7 | v21.9,46.6 22,46.6 | P1.R5 10.73,65.33 P1.R6 | P1.R4 P1.R6 | P1.R6 12.01,62.01 12,62
  other vias: 43.8,61.5 17.9,62 19.1,62 20.3,62 12.6,57.3 12.6,56 12.6,53.3 21.6,62 38.7,57
  pour Bottom (rank 2): -10.82,81.22 89.58,81.48 89.48,-3.75 -10.82,-3.41
  pour Top: 40.8,62.5 46.2,62.5 46.1,55.7 40.7,55.7
  pour Top: 17.3,60 17.3,62.82 22.97,62.81 22.97,59.99
  pour Top: 14.5,58.5 14.5,52 12,52 12,58.5
  pour Top: 36.5,58.5 36.5,55.5 39.4,55.5 39.4,58.5
ISET
  Top 0.178: U3.17 26.9,60.11 26.9,61.2 28.1,62.4 28.1,65.15 R34.2
L1-1  (via drill 0.35)  (1 unrouted)
  Top 0.178: JP2.6 4.63,24.19 R41.2 | U3.106 32.66,47.27 v31.9,46.5 | v6.1,44.67 v6.1,55.79
  Bottom 0.178: v31.9,46.5 31.9,45.3 30.1,43.5 7.27,43.5 v6.1,44.67 | v6.1,55.79 2.02,55.79 JP3.6
L1-2  (via drill 0.35)  (1 unrouted)
  Top 0.178: JP2.7 4.62,21.65 R42.2 | v32.7,46.5 32.97,46.77 U3.105 | v5.5,58.36 5.5,43.9 5.53,43.87 v6.1,43.87
  Bottom 0.178: v32.7,46.5 32.7,45.2 30.5,43 6.97,43 v6.1,43.87 | v5.5,58.36 JP3.7
L2-1  (via drill 0.35)  (1 unrouted)
  Top 0.178: U3.103 38.27,45.77 39.5,47 v52.5,47
  Bottom 0.178: JP4.6 53.19,47 v52.5,47 | R43.2 JP5.6
L2-2  (via drill 0.35)  (1 unrouted)
  Top 0.178: U3.102 34.92,43.9 37.1,43.9 39.6,46.4 v51.8,46.4
  Bottom 0.178: JP4.7 54.45,44.15 52.2,46.4 v51.8,46.4 | R44.2 54.45,34.4 JP5.7
L3-1  (via drill 0.35)
  Top 0.178: v32.9,42.2 32.88,42.19 U3.98 | v4.5,62.9 4.5,43 5.23,42.27 v6.1,42.27
  Bottom 0.178: v4.5,62.9 4.5,68.5 13.84,77.84 P1.L2 | v32.9,42.2 32.7,42 6.47,42 6.2,42.27 v6.1,42.27
L3-2  (via drill 0.35)
  Top 0.178: U3.97 32.38,42.88 32.1,42.6 v31.5,42.6 | P1.L4 3.78,77.42 7,74.2 7,72.4 4.3,69.7 4.3,66.2 4.9,65.6 4.9,63.5 5.3,63.1 5.3,62.8 4.9,62.4 4.9,43.2 5.03,43.07 v6.1,43.07
  Bottom 0.178: v31.5,42.6 31.4,42.5 6.77,42.5 6.2,43.07 v6.1,43.07
N$1
  Bottom 0.15: R6.2 14.41,9.81 18.4,13.8 20.7,13.8 | 20.7,13.8 26.8,13.8 27.48,14.47 T1.15 | T1.10 21.12,14.22 20.7,13.8
N$2
  Top 0.406: R1.1 R2.2 C1.1 67.6,73.59 U$11.A 59.5,74 57.8,72.3 57.8,70.31 U1.1
N$4
  Bottom 0.178: T2.15 56.84,14.29 56.52,13.97 50.83,13.97 | 50.83,13.97 50.49,14.3 50.49,15.34 | 50.49,15.34 50.49,15.74 | 50.83,13.97 46.05,13.97 R13.2 | T2.10 50.49,15.34
N$5  (via drill 0.35, 0.35 pad 0.41)
  Top 0.178: v46.7,26.7 47,26.7 48,25.7 50.9,25.7 51.1,25.9 v56.4,25.9
  Bottom 0.178: v56.4,25.9 56.4,22.69 X2.8 | R9.2 37.2,14.4 37.5,14.7 40.6,14.7 41.2,15.3 41.2,19.5 45,23.3 45,25 v46.7,26.7
N$6
  Top 0.406: R3.1 R4.2 69.2,51.75 66.95,49.5 U$12.A | U2.1 58.4,47.91 58.4,49.7 59.7,51 63,51 64.5,49.5 U$12.A | U$12.A 66.65,49.5 C4.1
N$7
  Bottom 0.15: R11.2 14.2,17.7 14.6,18.1
  Bottom 0.178: X1.4 16.75,22.65 14.6,20.5 14.6,18.1
N$8
  Bottom 0.15: R5.2 14.9,15.1 15.1,15.3
  Bottom 0.178: 15.1,15.3 15.1,20.4 15.8,21.1 20.9,21.1 X1.8
N$9
  Bottom 0.15: X1.7 20.27,19.2 18.4,19.2 16.1,16.9 16.1,12.3 15,11.2 R8.2
N$10
  Bottom 0.178: R19.1 R20.1 34.65,7.92 C9.1
N$11
  Bottom 0.15: X1.5 15.7,17.17 15.7,14.1 15.4,13.8 R17.2
N$12  (via drill 0.35 pad 0.41)
  Top 0.178: v46.7,24.9 47.1,24.9 47.5,24.5 52,24.5 52.4,24.9 v55.2,24.9
  Bottom 0.178: v55.2,24.9 55.2,20.13 X2.7 | v46.7,24.9 46.5,24.9 46,24.4 46,16.4 44.2,14.6 42.2,14.6 41.1,13.5 R12.2
N$13
  Bottom 0.178: R7.1 38.5,10 38.8,9.7 40.21,9.7 C11.1 41.8,9.76 42.16,9.76 | 42.16,9.76 42.4,10 R15.1 | R13.1 45.07,10.27 44.56,9.76 42.16,9.76
N$14
  Bottom 0.15: R11.1 12.3,17.7 12.5,17.5 12.5,16.4 | 12.5,16.4 12.5,15.3 12.3,15.1 R5.1 | 13.4,16.4 R10.2 12.5,16.4
N$15  (via drill 0.35, 0.35 pad 0.41)
  Top 0.178: v46.7,25.7 47,25.7 47.6,25.1 v51.4,25.1
  Bottom 0.178: v51.4,25.1 51.4,22.68 X2.4 | v46.7,25.7 45.6,24.6 45.6,22.9 41.9,19.2 41.9,15.05 40.95,14.1 40.2,14.1 39.8,13.7 R16.2
N$16
  Bottom 0.178: R9.1 37.2,11.8 37.5,12.1 38.5,12.1 | 38.5,12.1 39.5,12.1 39.8,11.8 R16.1 | R7.2 38.5,12.1
N$17
  Bottom 0.15: R17.1 12.3,13.8 12.5,13.6 12.5,12.5 | 12.5,12.5 12.5,11.4 12.3,11.2 R8.1 | R18.2 12.5,12.5
N$18  (via drill 0.35 pad 0.41)
  Top 0.178: v46.7,24 v52.6,24
  Bottom 0.178: v52.6,24 52.6,20.14 X2.5 | v46.7,24 46.7,15.95 44.95,14.2 44,14.2 43.7,13.9 R14.2
N$19
  Bottom 0.178: R12.1 41.1,11.9 41.3,12.1 42.5,12.1 | 42.5,12.1 43.5,12.1 43.7,11.9 R14.1 | R15.2 42.4,12.2 42.5,12.1
N$20
  Top 0.178: R41.1 14.16,24.16 15.5,25.5 29.5,25.5 30.25,26.25 LED4.A
N$23
  Top 0.406: LED1.A R27.1
N$24
  Top 0.406: LED2.A R28.1
N$26
  Top 0.406: LED3.A R29.1
N$27
  Top 0.178: R33.1 R32.1 C33.1
N$28
  Top 0.178: R42.1 12.37,21.66 15.7,25 29.4,25 30.25,24.15 LED5.A
N$29  (via drill 0.35)
  Top 0.178: v63.7,32.2 64.2,31.7 64.2,28.05 LED6.A
  Bottom 0.15: R43.1 63.25,32.65 v63.7,32.2
N$30  (via drill 0.35)
  Top 0.178: v64,24 64.25,23.75 LED7.A
  Bottom 0.15: 63,31.1 62.5,31.6 55,31.6 54.5,32.1
  Bottom 0.178: R44.1 54.5,32.1 | 63,31.1 64,30.1 v64,24
N$31
  Top 0.178: R46.1 R45.1 C44.1
N$32
  Bottom 0.15: R10.1 10.7,16.4 10.4,16.1 10.4,14.7 C12.1 10.2,12.9 10.6,12.5 | 10.6,12.5 R18.1 | R6.1 10.89,9.81 10.6,10.1 10.6,12.5
N$33
  Bottom 0.178: R22.1 R21.1 | R21.1 33.86,1.82 | C10.1 34.21,2.18 R21.1
N$34
  Top 0.178: 9.04,75.6 R48.2 8.57,76.32 P1.L3
N$35
  Top 0.178: R47.2 15.96,75.86 P1.L1
N$36
  Bottom 0.406: X2.G 45.4,4.74 C47.1
N$37
  Bottom 0.406: X1.G 8.6,7.46 C46.1
N$40
  Bottom 0.178: R23.1 63.84,8.44 R24.1 64.62,7.71 C13.1
N$41
  Bottom 0.178: R26.1 R25.1 65.12,2.08 C14.1
PS0
  Top 0.178: R31.1 37.72,51.27 U3.114
PS1
  Top 0.178: U3.113 38.27,50.77 39,51.5 R30.1
PW
  Top 0.406: CR1.1 65.8,63.2 L3.1
  pour Top (rank 3): 74,58.5 58,58.5 58,62 74,62
RST_N  (via drill 0.35)
  Top 0.178: U3.115 35.41,51.77 v35.21,51.57
  Bottom 0.178: v35.21,51.57 v35.22,51.56 35.22,49.45 36.04,48.63 U$9.A C45.1 R49.1
RX1_ISO_N  (via drill 0.35, 0.35 pad 0.41)  (1 unrouted)
  Top 0.15: 32.9,60.11 32.9,63.07 v32.34,63.62 | v8.4,56.54 8.15,56.79 8.15,60.44 10.06,62.35 15.35,62.35 17.2,64.2 v17.5,64.2
  Top 0.178: 32.9,60.08 U3.5 arc-90 32.9,60.11 | v5.2,9 v19.8,9
  Bottom 0.15: v32.34,63.62 31.31,64.66 17.95,64.66 v17.5,64.2 | v8.4,56.54 8.31,56.54 6.27,54.5 2.8,54.5 2,53.7 JP3.5 | T1.8 19.86,8.95
  Bottom 0.178: R21.2 31.7,1.37 23.33,1.37 19.8,4.9 19.8,6.79 T1.8 | JP2.5 4.27,26.73 4.5,26.5 4.5,9.7 v5.2,9 | 19.86,8.95 v19.8,9
RX1_ISO_P  (via drill 0.35, 0.35 pad 0.41)  (1 unrouted)
  Top 0.15: U3.4 33.38,63.62 v32.65,64.36 | v7.86,55.28 v7.85,55.29 7.85,60.56 9.94,62.65 14.94,62.65 17.25,64.97 v17.49,64.97
  Top 0.178: v5.4,10 15,10 15.5,10.5 v22.4,10.5 | U3.4 arc-90 33.4,60.11
  Bottom 0.15: JP3.4 3.29,50.73 7,54.43 7.01,54.43 v7.86,55.28 | v17.49,64.97 v17.5,64.96 32.05,64.96 v32.65,64.36
  Bottom 0.178: R22.2 30.26,2.1 23.26,2.1 22.39,2.97 T1.6 v22.4,10.5 | v5.4,10 5,10.4 5,27.1 2.83,29.27 JP2.4
RX1_M  (via drill 0.35)
  Top 0.15: X1.2 15.97,21.5 16.6,21.5 17.5,20.6 17.5,19.8 18.74,18.56 v19.87,18.56
  Bottom 0.178: T1.9 19.86,18.55 v19.87,18.56
RX1_P  (via drill 0.35)
  Top 0.178: v21.25,17.41 16.09,17.41 13.55,19.95 X1.1
  Bottom 0.178: v21.25,17.41 21.69,17.41 22.4,16.7 T1.11
RX2_ISO_N  (via drill 0.35, 0.35 pad 0.41)  (1 unrouted)
  Top 0.178: v49.2,13.3 49.9,14 60.5,14 v65,18.5 | U3.11 29.9,60.08 29.9,57.7 arc-90 v29.7,57.5 29.89,57.69 | v48.5,53.2 48.3,53 44.7,53 v44.5,53.2 | v30,55.6 v30,53.2
  Bottom 0.15: 49.22,7.25 T2.8 49.2,6.83 49.2,5.3 50.8,3.7 59,3.7 60.6,2.1 62.12,2.1
  Bottom 0.178: 62.12,2.1 R25.2 | v65,18.5 65,33 64.5,33.5 62,33.5 59.53,35.97 JP5.5 | v49.2,13.3 49.2,7.26 49.22,7.25 | v48.5,53.2 49.8,53.2 51.5,51.5 56,51.5 59.53,47.97 JP4.5 | v44.5,53.2 43.7,54 30.8,54 v30,53.2 | v30,55.6 30,57.2 v29.7,57.5
RX2_ISO_P  (via drill 0.35, 0.35 pad 0.41)  (1 unrouted)
  Top 0.178: v59.3,11.7 v51.7,11.7 | v44.5,52.4 v51.6,52.4 | v30.5,57.5 30.4,57.6 30.4,60.08 arc90 U3.10 | 30.5,55.3 v30.8,55.6 30.4,55.2 30.4,53.6 30.8,53.2 v30.8,52.4
  Bottom 0.15: T2.6 51.76,4.95 52.5,4.2 62.13,4.2 R26.2
  Bottom 0.178: 62.1,4.23 R26.2 | v59.3,11.7 65.8,18.2 65.8,33.4 65.2,34 64,34 62.07,35.93 JP5.4 | v51.7,11.7 51.7,7.3 51.76,7.25 T2.6 | v30.8,55.6 30.5,55.9 v30.5,57.5 | v51.6,52.4 56.1,52.4 60,48.5 60,45.27 JP4.4 | v44.5,52.4 43.3,53.6 32,53.6 v30.8,52.4
RX2_M
  Bottom 0.178: T2.9 49.22,17.48 49.02,17.68 49.02,22.45 X2.2
RX2_P  (via drill 0.35 pad 0.41)
  Top 0.178: v51.79,18.8 48.87,18.8 X2.1
  Bottom 0.178: v51.79,18.8 51.76,18.76 T2.11
RX3_ISO_N  (via drill 0.35)
  Top 0.15: 21.8,65.86 R46.2
  Top 0.178: v25.2,65.8 24.8,65.4 24.8,62 25.4,61.4 25.4,60.11 U3.20 | v22.8,65.86 21.8,65.86
  Bottom 0.15: 16.34,65.86 P1.R8
  Bottom 0.178: 25.14,65.86 v25.2,65.8 25.2,65.86 v22.8,65.86 16.34,65.86
RX3_ISO_P  (via drill 0.35)
  Top 0.178: 25.9,60.11 U3.19 25.89,61.41 25.3,62 25.3,64.9 25.82,65.42 v25.82,67.12 | v22.8,67.12 22.02,67.9 R45.2
  Bottom 0.178: v25.82,67.12 v22.8,67.12 13.8,67.12 P1.R7
SCL  (via drill 0.35)
  Top 0.178: R37.1 43.3,48.7 42.73,49.27 U3.110 34.23,49.27 v33.7,49.8 | R38.1 28.6,73.2 v33.5,68.3 | v32.5,55.6 31.2,54.3 31.2,53.8 32,53 32,52.2 v32.5,51.7
  Bottom 0.178: v33.5,68.3 33.5,66.5 34,66 34,60 32,58 32,56.1 v32.5,55.6 | v32.5,51.7 32.5,51 v33.7,49.8
SCL_CPU
  Top 0.178: R38.2 28.56,75.39 JP1.2
SCL_EEPROM  (via drill 0.35)
  Top 0.178: v50.1,48.7 R37.2
  Bottom 0.178: U4.6 48.53,45.23 50.1,46.8 v50.1,48.7
SDA  (via drill 0.35)
  Top 0.178: R35.1 43.8,50.8 42.8,49.8 36.74,49.8 U3.111 35.23,49.77 32.5,52.5 32.5,53 32,53.5 32,54.3 v33.3,55.6 | R36.1 31.1,71.5 v34.3,68.3
  Bottom 0.178: v34.3,68.3 34.3,66.7 34.5,66.5 34.5,59.7 32.5,57.7 32.5,56.4 v33.3,55.6
SDA_CPU
  Top 0.178: R36.2 JP1.3
SDA_EEPROM  (via drill 0.35)
  Top 0.178: v48.5,50.8 R35.2
  Bottom 0.178: U4.5 48.51,46.51 49,47 49,50.3 v48.5,50.8
SPIQ  (via drill 0.35)
  Top 0.178: R39.1 26.35,73.65 26.35,73.55 26.45,73.55 27.5,72.5 28.4,72.5 v32.6,68.3 | U3.109 33.73,48.77 v33.7,48.8 | v31.6,51.7 31.6,52.9 30.8,53.7 30.8,54.8 v31.6,55.6
  Bottom 0.178: v31.6,55.6 31.6,58.6 33.5,60.5 33.5,65.5 32.6,66.4 v32.6,68.3 | v31.6,51.7 31.6,50.9 v33.7,48.8
SPIQ_CPU
  Top 0.178: R39.2 26.02,75.37 JP1.1
SPIS-N  (via drill 0.35)
  Top 0.178: R40.1 33.6,69.8 v35.1,68.3 | 36.67,50.3 U3.112 35.53,50.27 33,52.8 33,53 32.5,53.5 32.5,54 v34.1,55.6
  Bottom 0.178: v35.1,68.3 35.1,59.5 33,57.4 33,56.7 v34.1,55.6
SPIS-N_CPU
  Top 0.178: R40.2 33.64,75.39 JP1.4
TX1_ISO_N  (via drill 0.35, 0.35 pad 0.41)  (1 unrouted)
  Top 0.15: v8.52,47.85 8.52,53.81 10.15,55.44 10.15,59.94 11.26,61.05 15.65,61.05 v15.78,61.18
  Top 0.178: 31.4,60.08 U3.8 arc-90 31.4,60.11 v31.4,62 v31.41,62.01 | v6.3,11.5 14.5,11.5 15,12 v26.2,12
  Bottom 0.15: JP3.2 4.2,47.85 v8.52,47.85 | v15.78,61.18 16.14,61.18 18.09,63.13 30.36,63.13 31.41,62.08 v31.41,62.01 | 6.3,28.55 v6.3,11.5
  Bottom 0.178: R19.2 31.7,5.69 26.41,5.69 26.2,5.9 T1.3 | 6.3,28.55 4,30.85 4,32.35 JP2.2 | T1.3 | T1.3 v26.2,12
TX1_ISO_P  (via drill 0.35, 0.35 pad 0.41)  (1 unrouted)
  Top 0.15: 31.9,60.11 31.9,61.57 32.02,61.69 v32.02,62.79 v32.02,62.8 | v7.83,48.42 7.83,53.54 9.85,55.56 9.85,60.06 11.14,61.35 15.13,61.35 v15.78,62
  Top 0.178: v5.8,10.8 14.8,10.8 15.3,11.3 v28.6,11.3 | U3.7 arc-90 31.9,60.11
  Bottom 0.15: v32.02,62.8 32.02,62.89 31.48,63.43 17.97,63.43 16.54,62 v15.78,62 | JP3.3 2.04,48.15 7.55,48.15 v7.83,48.42
  Bottom 0.178: R20.2 31.7,7.9 28.84,7.9 28.75,8 | v5.8,10.8 5.6,11 5.6,28.21 JP2.3 | T1.1 28.75,8 | 28.75,8 28.75,11.15 v28.6,11.3
TX1_M  (via drill 0.35)
  Top 0.15: X1.6 20.45,22.65 v23,20.1
  Bottom 0.15: T1.14 26.2,16.3 23,19.5 v23,20.1
TX1_P  (via drill 0.35)
  Top 0.178: X1.3 18.2,18 22,18 23.3,16.7 v28.6,16.7
  Bottom 0.178: v28.6,16.7 28.75,16.55 T1.16
TX2_ISO_N  (via drill 0.35, 0.35 pad 0.41)  (1 unrouted)
  Top 0.178: 28.4,60.08 U3.14 | v44.5,54.9 45.4,54 47.6,54 v48.5,54.9 | U3.14 28.39,58.16 28.12,57.89 28.12,57.12 v28.32,56.92 | U3.14 | v55.6,13.2 v63.08,13.2
  Bottom 0.15: T2.3 55.6,6.88 | 63.12,13.2 63.27,13.2 66.65,16.58 66.65,36.5 JP5.2 | 55.88,5.54 60.02,5.54 60.81,6.33 R23.2
  Bottom 0.178: 55.88,5.54 55.56,5.85 T2.3 | R23.2 | v44.5,54.9 28.6,54.9 28.5,55 28.5,56.74 v28.32,56.92 | v48.5,54.9 49.1,54.9 50.5,53.5 56.85,53.5 61,49.35 61,46.5 61.5,46 65.5,46 67.15,44.35 JP4.2 | 55.6,6.88 v55.6,13.2 | v63.08,13.2 63.12,13.2
TX2_ISO_P  (via drill 0.35, 0.35 pad 0.41)  (1 unrouted)
  Top 0.178: v61.2,12.5 v58.1,12.5 | v28.8,57.5 28.9,57.6 28.9,60.08 arc90 U3.13 | v48.5,54 48,53.5 45,53.5 v44.5,54 | v29.1,55.6 29.4,55.3 v29.4,54
  Bottom 0.15: v61.2,12.5 61.44,12.5 62.78,13.84 63.34,13.84 66.35,16.85 66.35,33.6 64.61,35.34 JP5.3 | v58.1,12.5 58.19,12.41 58.19,6.93 | 58.19,6.93 T2.1 | 58.19,6.93 60.23,6.93 61.77,8.47 R24.2
  Bottom 0.178: 62.12,8.42 R24.2 | v44.5,54 44,54.5 29.9,54.5 v29.4,54 | v48.5,54 49.5,54 50.5,53 56.5,53 60.5,49 60.5,46 61,45.5 63.5,45.5 64.61,44.39 JP4.3 | v28.8,57.5 29.5,56.8 29.5,56 v29.1,55.6
TX2_M  (via drill 0.35 pad 0.41)
  Top 0.178: v53.98,18.75 54.03,18.69 v55.55,18.69
  Bottom 0.178: v53.98,18.75 53.98,22.58 X2.6 | v55.55,18.69 55.56,18.68 T2.14
TX2_P  (via drill 0.35 pad 0.41)
  Top 0.178: v50.39,17.78 50.42,17.75 v58.09,17.75
  Bottom 0.178: v50.39,17.78 50.39,19.81 X2.3 | v58.09,17.75 58.1,17.74 T2.16
TX3_ISO_N  (via drill 0.35)
  Top 0.178: 23.9,60.11 U3.23 23.89,70.61 v23.3,71.2 22.65,71.2 R33.2
  Bottom 0.178: v23.3,71.2 19.9,67.8 8,67.8 6.92,66.72 P1.R2
TX3_ISO_P  (via drill 0.35)
  Top 0.178: U3.22 24.4,60.11 v24.4,72.2 22.4,74.2 R32.2
  Bottom 0.178: P1.R1 7.26,68.2 19.4,68.2 23.4,72.2 v24.4,72.2
X1
  Top 0.178: Y1.1 44.25,58.6 42.05,58.6 C41.1 41.55,58.25 40.3,57 40.3,56 39.06,54.77 U3.121
X2
  Top 0.178: Y1.3 43.5,59.65 C42.1 39.9,57.85 39.9,56.2 38.97,55.27 U3.122

### Text on the board
tPlace: ArmazEthernet / Rev A2 | ArmazEthernet / Rev A2